# Altium project RFSoC-AMC.PrjPCB (part 21 of 22)
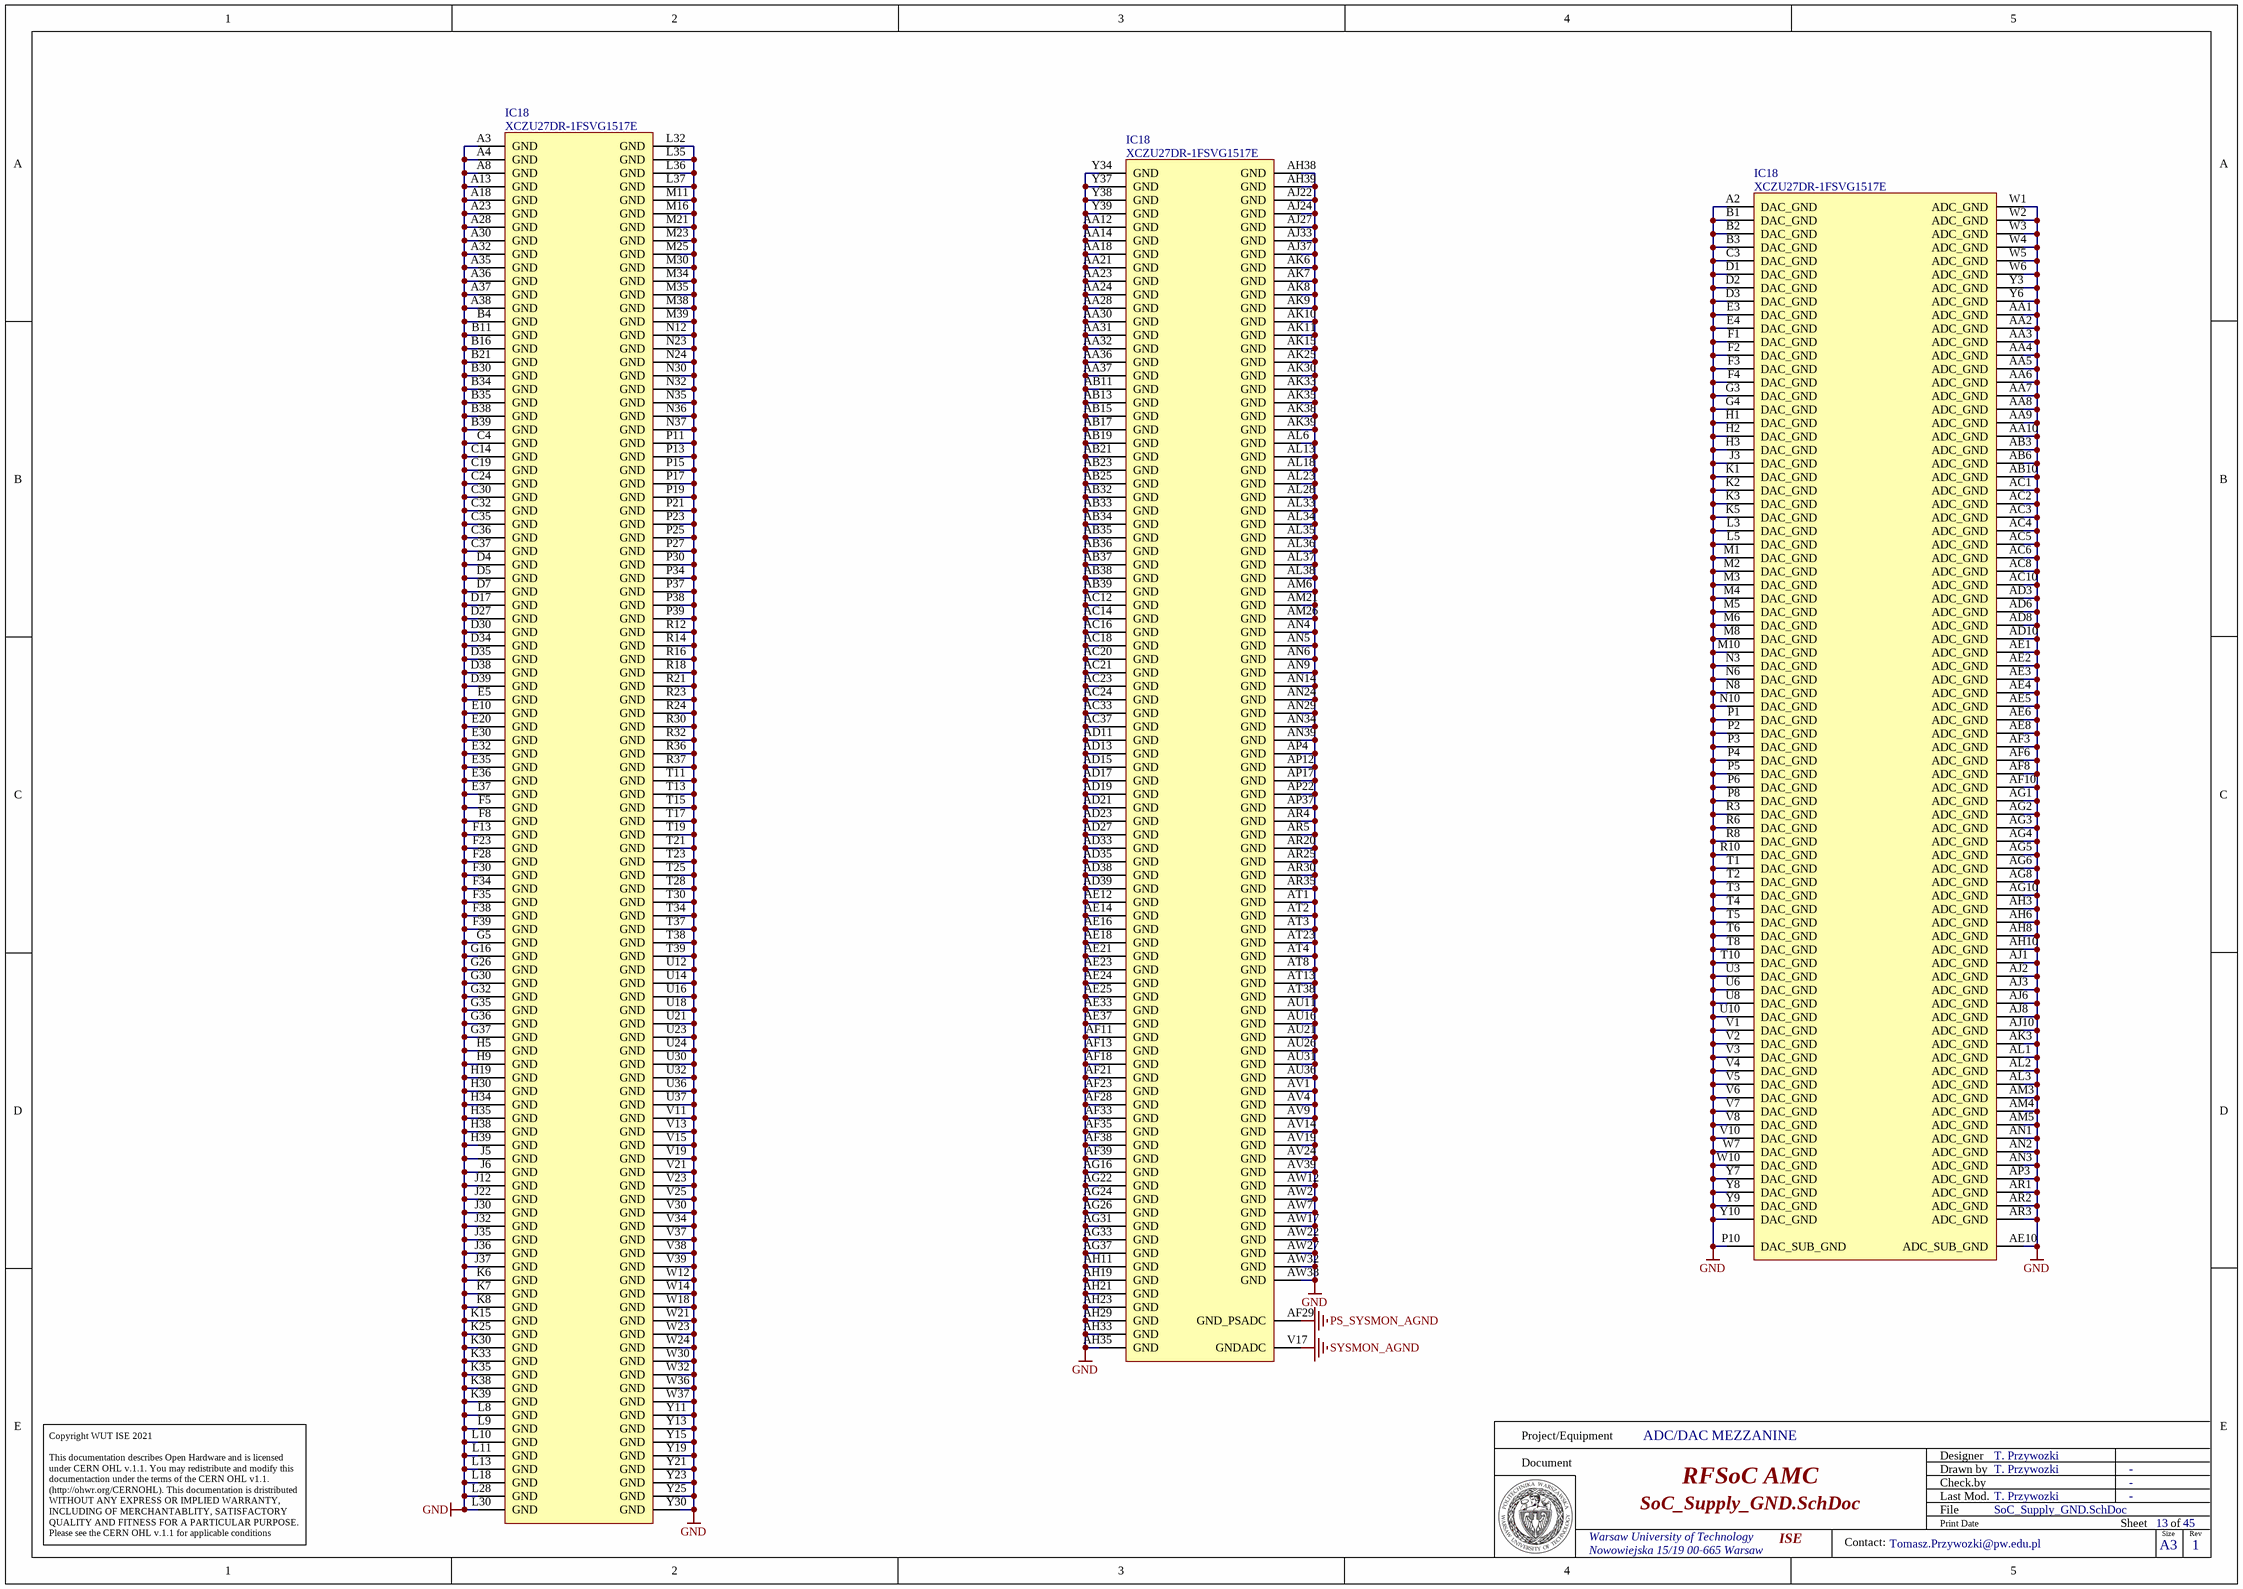
[diagram p47: SoC_Supply_GND.SchDoc]
## Nets that join several sheets
ADC_AVCC: ADC_DAC_Supply (6 pins), SoC_Supply (8 pins), SoC_Decoupling_2 (5 pins)
ADC_AVCCAUX: Supply (L49.2), SoC_Supply (8 pins), SoC_Decoupling_2 (18 pins)
AMS_CLK_VCC3V3: U_ADC_PLL (6 pins), DAC_PLL (6 pins), U_ADC_PLL (6 pins), AMS_CLOCK (13 pins), Supply_LDOs (6 pins), CDR_WR_oscillators (11 pins), SoC_FPGA_128-131_GTY (21 pins), SoC_PS_505_GTR (7 pins)
DAC_AVCC: ADC_DAC_Supply (6 pins), SoC_Supply (8 pins), SoC_Decoupling_2 (5 pins)
DAC_AVCCAUX: ADC_DAC_Supply (6 pins), SoC_Supply (8 pins), SoC_Decoupling_2 (6 pins)
DAC_AVTT: RFMC_DAC (6 pins), Power_Management_RFMC_RTM (C743.2 L5.2), SoC_Supply (IC18.H4 IC18.J4 IC18.K4 IC18.L4), SoC_Decoupling_2 (6 pins)
GND: soc (45 pins), U_DDR4_SDRAM_PL1 (166 pins), RFMC_ADC (268 pins), RFMC_DAC (253 pins), U_DDR4_SDRAM_PL2 (166 pins), U_DDR4_SDRAM_PS (166 pins), U_ADC_PLL (51 pins), DAC_PLL (51 pins), U_ADC_PLL (51 pins), AMS_CLOCK (121 pins), RTM_Connector (61 pins), ETH_PHY_SW_L2L3 (61 pins), AMC_Connector (56 pins), CPU_LPC1776_1 (18 pins), CPU_LPC1776_2 (53 pins), I2C_MUX (13 pins), SD_CARD (13 pins), MLVDS_Transceivers (30 pins), USB_SERIAL_QUAD (59 pins), Thermometers (34 pins), Power_Management_RFMC_RTM (53 pins), ADC_DAC_Supply (22 pins), Supply_CORE (81 pins), Supply_LDOs (21 pins), Supply (135 pins), VCCINT_IO_BRAM_PS (37 pins), CDR_WR_oscillators (57 pins), SoC_FPGA_67_68_69_DDR4 (21 pins), SoC_FPGA_64_65_66_DDR4 (15 pins), SoC_224-229_ADC_DAC (R512.2 R513.2), SoC_FPGA_128-131_GTY (15 pins), SoC_FPGA_Config_0 (R515#2.1 R539.1), SoC_Supply (6 pins), SoC_PS_504_DDR4 (R582.2), SoC_PS_505_GTR (6 pins), SoC_PS_Config_503 (15 pins), SoC_PS_500_501_502_MIO (30 pins), JTAG_Configuration (30 pins), USB3_CON (12 pins), USB_PHY (11 pins), FPGA_7A35T (29 pins), FPGA_7A35T_GTP (C904.1 OSC8.3 R714.1 R715.1), Clocking_SI5341B (13 pins), FPGA_7A35T_POWER (146 pins), SoC_Decoupling (89 pins), SoC_Decoupling_2 (63 pins), SoC_Supply_GND (529 pins)
MGT1V2: Supply (10 pins), SoC_Supply (21 pins), SoC_Decoupling (C669.2 C670.2), SoC_Decoupling_2 (C695.2)
MGT1V8: Supply_LDOs (C290.2 L6.2 R315.2 TP19.1), SoC_Supply (6 pins), SoC_Decoupling_2 (C702.2 C703.2)
MGTAVCC: Supply (6 pins), SoC_Supply (6 pins), SoC_Decoupling_2 (9 pins)
MGTAVCCF: Supply (C361.2 L1.2 L24.2), FPGA_7A35T_POWER (9 pins)
MGTAVTTF: Supply (C362.2 L2.2 L25.2), FPGA_7A35T_GTP (R713.1), FPGA_7A35T_POWER (11 pins)
MGTRAVCC: Supply_LDOs (6 pins), SoC_Supply (IC18.AD34 IC18.AF34 IC18.AH34), SoC_Decoupling_2 (C701.2)
P1V0: Supply (9 pins), FPGA_7A35T_POWER (39 pins)
P1V2: U_DDR4_SDRAM_PL1 (131 pins), U_DDR4_SDRAM_PL2 (131 pins), U_DDR4_SDRAM_PS (131 pins), Supply (12 pins), SoC_FPGA_67_68_69_DDR4 (6 pins), SoC_FPGA_64_65_66_DDR4 (R369.1 R440.2), SoC_Supply (25 pins), SoC_Decoupling (16 pins)
P1V8: RFMC_ADC (C78.2 C79.1 J1.a6 J1.c6), RFMC_DAC (C776.2 C932.1 J21.a35 J21.c35), ETH_PHY_SW_L2L3 (21 pins), SD_CARD (C548.1 IC48.5 R452.2), USB_SERIAL_QUAD (C848.2 IC50.6), Supply (8 pins), SoC_FPGA_Config_0 (R538.2), SoC_Supply (20 pins), SoC_PS_500_501_502_MIO (22 pins), USB_PHY (L8.1 L62.1), FPGA_7A35T (R669.1), Clocking_SI5341B (5 pins), FPGA_7A35T_POWER (15 pins), SoC_Decoupling (15 pins)
P1V13: ADC_DAC_Supply (8 pins), Supply_LDOs (C293.2 C294.2 IC16.9 IC16.10), Supply (6 pins)
P2V5: U_DDR4_SDRAM_PL1 (18 pins), U_DDR4_SDRAM_PL2 (18 pins), U_DDR4_SDRAM_PS (18 pins), Power_Management_RFMC_RTM (5 pins), ADC_DAC_Supply (C309.2 C310.2 IC20.9 IC20.10), Supply_LDOs (C93.2 IC15.9 IC15.10), FPGA_7A35T (5 pins), FPGA_7A35T_GTP (L68.2), FPGA_7A35T_POWER (15 pins)
P3V3: U_DDR4_SDRAM_PL1 (C5_U_DDR4_SDRAM_PL1.1 IC5_U_DDR4_SDRAM_PL1.7 IC5_U_DDR4_SDRAM_PL1.10), RFMC_ADC (12 pins), RFMC_DAC (11 pins), U_DDR4_SDRAM_PL2 (C5_U_DDR4_SDRAM_PL2.1 IC5_U_DDR4_SDRAM_PL2.7 IC5_U_DDR4_SDRAM_PL2.10), U_DDR4_SDRAM_PS (C5_U_DDR4_SDRAM_PS.1 IC5_U_DDR4_SDRAM_PS.7 IC5_U_DDR4_SDRAM_PS.10), ETH_PHY_SW_L2L3 (L34.1), CPU_LPC1776_1 (R37.2), I2C_MUX (10 pins), SD_CARD (7 pins), MLVDS_Transceivers (22 pins), USB_SERIAL_QUAD (6 pins), ADC_DAC_Supply (6 pins), Supply_LDOs (C291.2 C298.2 IC15.4 IC16.4), Supply (6 pins), CDR_WR_oscillators (R468.1), SoC_Supply (6 pins), SoC_PS_Config_503 (15 pins), SoC_PS_500_501_502_MIO (8 pins), JTAG_Configuration (15 pins), USB3_CON (LD14.2), USB_PHY (C823.2 IC71.20 IC71.21), FPGA_7A35T (11 pins), Clocking_SI5341B (19 pins), FPGA_7A35T_POWER (20 pins), SoC_Decoupling (5 pins)
P3V3MP: AMC_Connector (P1.4), CPU_LPC1776_1 (23 pins), CPU_LPC1776_2 (41 pins), I2C_MUX (22 pins), USB_SERIAL_QUAD (C818.2 C854.2 IC53.6 IC58.6), Thermometers (27 pins), Power_Management_RFMC_RTM (12 pins), ADC_DAC_Supply (R329.2 R333.2 R383.2), Supply_LDOs (R321.2 R326.2 R328.2), Supply (R107.2 R109.2 R131.2), VCCINT_IO_BRAM_PS (R654.2), SoC_FPGA_67_68_69_DDR4 (C746.2 C799.2 IC45.6 IC46.6), SoC_PS_500_501_502_MIO (6 pins), JTAG_Configuration (5 pins)
P3V3MP_RTM: RTM_Connector (J4.c2), Power_Management_RFMC_RTM (F1.2)
P3V5: Supply_LDOs (C285.2 IC7.9 IC7.10 R188.2), Supply (6 pins)
P5V0: Power_Management_RFMC_RTM (5 pins), USB3_CON (C819.2 IC70.7)
P12V0: RFMC_ADC (C80.2 C81.1 C82.1), RFMC_DAC (8 pins), Power_Management_RFMC_RTM (21 pins), Supply_CORE (30 pins), Supply (33 pins), VCCINT_IO_BRAM_PS (11 pins)
P12V0_Molex: CPU_LPC1776_2 (R377.2), Power_Management_RFMC_RTM (10 pins)
P12V0_RTM: RTM_Connector (J4.a1 J4.a2 J4.b1 J4.b2), Power_Management_RFMC_RTM (IC40.2 R389.2 R390.2)
PAYLOAD_PWR: AMC_Connector (8 pins), Power_Management_RFMC_RTM (5 pins)
PSADC_GND: SoC_Supply (C803.1 C804.1 L55.2), SoC_Supply_GND (IC18.AF29)
SYSMON_AGND: SoC_FPGA_Config_0 (IC18.W16 IC18.W17 IC18.Y16 R541.2), SoC_Supply (C741.1 C742.1 L42.2), SoC_Supply_GND (IC18.V17)
VCCAUXF: Supply (L7.2), FPGA_7A35T_POWER (13 pins)
VCCBRAMF: Supply (C363.2 L3.2), FPGA_7A35T_POWER (7 pins)
VCCINT: Supply_CORE (37 pins), SoC_FPGA_Config_0 (R514#2.2), SoC_Supply (60 pins), SoC_Decoupling (13 pins)
VCCINT_AMS: Supply (10 pins), SoC_Supply (9 pins), SoC_Decoupling_2 (10 pins)
VCCINT_IO_BRAM_PS_SDFEC: VCCINT_IO_BRAM_PS (19 pins), SoC_Supply (38 pins), SoC_Decoupling (38 pins)
VDD33: I2C_MUX (R145.1 R146.1), Supply_CORE (6 pins)
ADC0_IN_N: RFMC_ADC (J1.f9), SoC_224-229_ADC_DAC (IC18.AP1)
ADC0_IN_P: RFMC_ADC (J1.g9), SoC_224-229_ADC_DAC (IC18.AP2)
ADC1_IN_N: RFMC_ADC (J1.b10), SoC_224-229_ADC_DAC (IC18.AM1)
ADC1_IN_P: RFMC_ADC (J1.c10), SoC_224-229_ADC_DAC (IC18.AM2)
ADC2_IN_N: RFMC_ADC (J1.f12), SoC_224-229_ADC_DAC (IC18.AK1)
ADC2_IN_P: RFMC_ADC (J1.g12), SoC_224-229_ADC_DAC (IC18.AK2)
ADC3_IN_N: RFMC_ADC (J1.b13), SoC_224-229_ADC_DAC (IC18.AH1)
ADC3_IN_P: RFMC_ADC (J1.c13), SoC_224-229_ADC_DAC (IC18.AH2)
ADC4_IN_N: RFMC_ADC (J1.f15), SoC_224-229_ADC_DAC (IC18.AF1)
ADC4_IN_P: RFMC_ADC (J1.g15), SoC_224-229_ADC_DAC (IC18.AF2)
ADC5_IN_N: RFMC_ADC (J1.b16), SoC_224-229_ADC_DAC (IC18.AD1)
ADC5_IN_P: RFMC_ADC (J1.c16), SoC_224-229_ADC_DAC (IC18.AD2)
ADC6_IN_N: RFMC_ADC (J1.f18), SoC_224-229_ADC_DAC (IC18.AB1)
ADC6_IN_P: RFMC_ADC (J1.g18), SoC_224-229_ADC_DAC (IC18.AB2)
ADC7_IN_N: RFMC_ADC (J1.b19), SoC_224-229_ADC_DAC (IC18.Y1)
ADC7_IN_P: RFMC_ADC (J1.c19), SoC_224-229_ADC_DAC (IC18.Y2)
ADCIO_0: RFMC_ADC (J1.a2), FPGA_7A35T (IC84.R6)
ADCIO_1: RFMC_ADC (J1.a4), FPGA_7A35T (IC84.T3)
ADCIO_2: RFMC_ADC (J1.b1), FPGA_7A35T (IC84.P6)
ADCIO_3: RFMC_ADC (J1.b3), FPGA_7A35T (IC84.R7)
ADCIO_4: RFMC_ADC (J1.b5), FPGA_7A35T (IC84.U1)
ADCIO_5: RFMC_ADC (J1.c2), FPGA_7A35T (IC84.V7)
ADCIO_6: RFMC_ADC (J1.c4), FPGA_7A35T (IC84.U4)
ADCIO_7: RFMC_ADC (J1.d1), FPGA_7A35T (IC84.P5)
ADCIO_8: RFMC_ADC (J1.d3), FPGA_7A35T (IC84.U5)
ADCIO_9: RFMC_ADC (J1.d5), FPGA_7A35T (IC84.V2)
ADCIO_10: RFMC_ADC (J1.e2), FPGA_7A35T (IC84.V8)
ADCIO_11: RFMC_ADC (J1.e4), FPGA_7A35T (IC84.V4)
ADCIO_12: RFMC_ADC (J1.f1), FPGA_7A35T (IC84.R5)
ADCIO_13: RFMC_ADC (J1.f3), FPGA_7A35T (IC84.V6)
ADCIO_14: RFMC_ADC (J1.f5), FPGA_7A35T (IC84.T4)
ADCIO_15: RFMC_ADC (J1.g2), FPGA_7A35T (IC84.U6)
ADCIO_16: RFMC_ADC (J1.g4), FPGA_7A35T (IC84.T5)
ADCIO_17: RFMC_ADC (J1.h1), FPGA_7A35T (IC84.T7)
ADCIO_18: RFMC_ADC (J1.h3), FPGA_7A35T (IC84.U7)
ADCIO_19: RFMC_ADC (J1.h5), FPGA_7A35T (IC84.V3)
ADCLK_IN0_N: RFMC_ADC (J1.b36), U_ADC_PLL (C224_U_ADC_PLL#1.2)
ADCLK_IN0_P: RFMC_ADC (J1.c36), U_ADC_PLL (C91_U_ADC_PLL#1.2)
ADCLK_IN1_N: RFMC_ADC (J1.f35), U_ADC_PLL (C227_U_ADC_PLL#1.2)
ADCLK_IN1_P: RFMC_ADC (J1.g35), U_ADC_PLL (C769_U_ADC_PLL#1.2)
ADCLK_IN2_N: RFMC_ADC (J1.b39), U_ADC_PLL (C224_U_ADC_PLL#2.2)
ADCLK_IN2_P: RFMC_ADC (J1.c39), U_ADC_PLL (C91_U_ADC_PLL#2.2)
ADCLK_IN3_N: RFMC_ADC (J1.f38), U_ADC_PLL (C227_U_ADC_PLL#2.2)
ADCLK_IN3_P: RFMC_ADC (J1.g38), U_ADC_PLL (C769_U_ADC_PLL#2.2)
AMC_CLK_N: RTM_Connector (J4.b3), Clocking_SI5341B (IC83.58)
AMC_CLK_P: RTM_Connector (J4.a3), Clocking_SI5341B (IC83.59)
AMC_En: AMC_Connector (P1.41), CPU_LPC1776_1 (R191.1 R194.1), CPU_LPC1776_2 (D12.1 R228.1 T1.1 T13.3)
AMC_TCK: AMC_Connector (P1.165), JTAG_Configuration (D16.1 IC34.9 R356.2)
AMC_TCLKA_N: RTM_Connector (J4.b4), CDR_WR_oscillators (IC22.4)
AMC_TCLKA_P: RTM_Connector (J4.a4), CDR_WR_oscillators (IC22.3)
AMC_TDI: AMC_Connector (P1.169), JTAG_Configuration (D14.1 IC34.4 R355.2)
AMC_TDO: AMC_Connector (P1.168), JTAG_Configuration (D17.1 IC34.7 R354.2)
AMC_TMS: AMC_Connector (P1.166), JTAG_Configuration (D15.1 IC34.12 R353.2)
AMC_TRSTn: AMC_Connector (P1.167), JTAG_Configuration (D13.1 D18.1 R352.2 R361.2)
ARTIX_FPGA_SCL: I2C_MUX (B19.1 IC32.19 R325.1), FPGA_7A35T (IC84.R13)
ARTIX_FPGA_SDA: I2C_MUX (B18.1 IC32.20 R322.1), FPGA_7A35T (IC84.T13)
ARTIX_SoC_Rx0_N: SoC_FPGA_128-131_GTY (C516.2 IC18.G34), FPGA_7A35T_GTP (C1009.2)
ARTIX_SoC_Rx0_P: SoC_FPGA_128-131_GTY (C518.2 IC18.G33), FPGA_7A35T_GTP (C1008.2)
ARTIX_SoC_Rx1_N: SoC_FPGA_128-131_GTY (C509.2 IC18.H32), FPGA_7A35T_GTP (C1011.2)
ARTIX_SoC_Rx1_P: SoC_FPGA_128-131_GTY (C512.2 IC18.H31), FPGA_7A35T_GTP (C1010.2)
ARTIX_SoC_Tx0_N: SoC_FPGA_128-131_GTY (C515.2 IC18.H37), FPGA_7A35T_GTP (C910.1)
ARTIX_SoC_Tx0_P: SoC_FPGA_128-131_GTY (C517.2 IC18.H36), FPGA_7A35T_GTP (C909.1)
ARTIX_SoC_Tx1_N: SoC_FPGA_128-131_GTY (C508.2 IC18.J39), FPGA_7A35T_GTP (C912.1)
ARTIX_SoC_Tx1_P: SoC_FPGA_128-131_GTY (C511.2 IC18.J38), FPGA_7A35T_GTP (C911.1)
ARTIX_TCK: JTAG_Configuration (IC35.16), FPGA_7A35T (IC84.F8)
ARTIX_TDI: JTAG_Configuration (R50.1), FPGA_7A35T (IC84.T9)
ARTIX_TDO: JTAG_Configuration (R368.2), FPGA_7A35T (IC84.T8)
ARTIX_TMS: JTAG_Configuration (IC35.13), FPGA_7A35T (IC84.R8)
ARTIX_UART_Rx: SoC_FPGA_HD_84_87 (IC18.AV6), FPGA_7A35T (IC84.N14)
ARTIX_UART_Tx: SoC_FPGA_HD_84_87 (IC18.AV5), FPGA_7A35T (IC84.M14)
BOOT_MODE0: CPU_LPC1776_1 (IC24.P9), SoC_PS_Config_503 (R593.2)
BOOT_MODE1: CPU_LPC1776_1 (IC24.P11), SoC_PS_Config_503 (R591.2)
BOOT_MODE2: CPU_LPC1776_1 (IC24.P3), SoC_PS_Config_503 (R589.2)
BOOT_MODE3: CPU_LPC1776_1 (IC24.N5), SoC_PS_Config_503 (R587.2)
CDR_CLK_CLEAN2_N: CDR_WR_oscillators (C594.2), FPGA_7A35T (IC84.D15 R694.2)
CDR_CLK_CLEAN2_P: CDR_WR_oscillators (C591.2), FPGA_7A35T (IC84.E15 R693.2)
CDR_CLK_CTRL.CDR_CLK_CLEAN1_N: CDR_WR_oscillators (C596.2), FPGA_7A35T_GTP (IC84.B5)
CDR_CLK_CTRL.CDR_CLK_CLEAN1_P: CDR_WR_oscillators (C595.2), FPGA_7A35T_GTP (IC84.B6)
CLK_4208_IN1_N: AMS_CLOCK (C138.1 R64.1), CDR_WR_oscillators (C582.2)
CLK_4208_IN1_P: AMS_CLOCK (C137.1 R64.2), CDR_WR_oscillators (C581.2)
CSB_ADC0: U_ADC_PLL (R167_U_ADC_PLL#1.2), FPGA_7A35T (IC84.T18)
CSB_ADC1: U_ADC_PLL (R167_U_ADC_PLL#2.2), FPGA_7A35T (IC84.T17)
CSB_DAC: DAC_PLL (R93.2), FPGA_7A35T (IC84.R18)
DAC0_OUT_N: RFMC_DAC (J21.b10), SoC_224-229_ADC_DAC (IC18.U1)
DAC0_OUT_P: RFMC_DAC (J21.c10), SoC_224-229_ADC_DAC (IC18.U2)
DAC1_OUT_N: RFMC_DAC (J21.f11), SoC_224-229_ADC_DAC (IC18.R1)
DAC1_OUT_P: RFMC_DAC (J21.g11), SoC_224-229_ADC_DAC (IC18.R2)
DAC2_OUT_N: RFMC_DAC (J21.b13), SoC_224-229_ADC_DAC (IC18.N1)
DAC2_OUT_P: RFMC_DAC (J21.c13), SoC_224-229_ADC_DAC (IC18.N2)
DAC3_OUT_N: RFMC_DAC (J21.f14), SoC_224-229_ADC_DAC (IC18.L1)
DAC3_OUT_P: RFMC_DAC (J21.g14), SoC_224-229_ADC_DAC (IC18.L2)
DAC4_OUT_N: RFMC_DAC (J21.b16), SoC_224-229_ADC_DAC (IC18.J1)
DAC4_OUT_P: RFMC_DAC (J21.c16), SoC_224-229_ADC_DAC (IC18.J2)
DAC5_OUT_N: RFMC_DAC (J21.f17), SoC_224-229_ADC_DAC (IC18.G1)
DAC5_OUT_P: RFMC_DAC (J21.g17), SoC_224-229_ADC_DAC (IC18.G2)
DAC6_OUT_N: RFMC_DAC (J21.b19), SoC_224-229_ADC_DAC (IC18.E1)
DAC6_OUT_P: RFMC_DAC (J21.c19), SoC_224-229_ADC_DAC (IC18.E2)
DAC7_OUT_N: RFMC_DAC (J21.f20), SoC_224-229_ADC_DAC (IC18.C1)
DAC7_OUT_P: RFMC_DAC (J21.g20), SoC_224-229_ADC_DAC (IC18.C2)
DACIO_0: RFMC_DAC (J21.a37), FPGA_7A35T (IC84.J6)
DACIO_1: RFMC_DAC (J21.a39), FPGA_7A35T (IC84.K6)
DACIO_2: RFMC_DAC (J21.b36), FPGA_7A35T (IC84.M6)
DACIO_3: RFMC_DAC (J21.b38), FPGA_7A35T (IC84.N6)
DACIO_4: RFMC_DAC (J21.b40), FPGA_7A35T (IC84.L5)
DACIO_5: RFMC_DAC (J21.c37), FPGA_7A35T (IC84.M5)
DACIO_6: RFMC_DAC (J21.c39), FPGA_7A35T (IC84.L4)
DACIO_7: RFMC_DAC (J21.d36), FPGA_7A35T (IC84.M4)
DACIO_8: RFMC_DAC (J21.d38), FPGA_7A35T (IC84.L3)
DACIO_9: RFMC_DAC (J21.d40), FPGA_7A35T (IC84.M2)
DACIO_10: RFMC_DAC (J21.e37), FPGA_7A35T (IC84.P1)
DACIO_11: RFMC_DAC (J21.e39), FPGA_7A35T (IC84.M1)
DACIO_12: RFMC_DAC (J21.f36), FPGA_7A35T (IC84.N1)
DACIO_13: RFMC_DAC (J21.f38), FPGA_7A35T (IC84.L2)
DACIO_14: RFMC_DAC (J21.f40), FPGA_7A35T (IC84.K1)
DACIO_15: RFMC_DAC (J21.g37), FPGA_7A35T (IC84.K3)
DACIO_16: RFMC_DAC (J21.g39), FPGA_7A35T (IC84.K5)
DACIO_17: RFMC_DAC (J21.h36), FPGA_7A35T (IC84.K2)
DACIO_18: RFMC_DAC (J21.h38), FPGA_7A35T (IC84.J4)
DACIO_19: RFMC_DAC (J21.h40), FPGA_7A35T (IC84.J5)
DACLK_IN0_N: RFMC_DAC (J21.b4), DAC_PLL (C88.2)
DACLK_IN0_P: RFMC_DAC (J21.c4), DAC_PLL (C87.2)
DACLK_IN1_N: RFMC_DAC (J21.f5), DAC_PLL (C89.2)
DACLK_IN1_P: RFMC_DAC (J21.g5), DAC_PLL (C90.2)
DDR4_1_A0: U_DDR4_SDRAM_PL2 (5 pins), SoC_FPGA_64_65_66_DDR4 (IC18.AK17)
DDR4_1_A1: U_DDR4_SDRAM_PL2 (5 pins), SoC_FPGA_64_65_66_DDR4 (IC18.AL15)
DDR4_1_A2: U_DDR4_SDRAM_PL2 (5 pins), SoC_FPGA_64_65_66_DDR4 (IC18.AN15)
DDR4_1_A3: U_DDR4_SDRAM_PL2 (5 pins), SoC_FPGA_64_65_66_DDR4 (IC18.AM15)
DDR4_1_A4: U_DDR4_SDRAM_PL2 (5 pins), SoC_FPGA_64_65_66_DDR4 (IC18.AN16)
DDR4_1_A5: U_DDR4_SDRAM_PL2 (5 pins), SoC_FPGA_64_65_66_DDR4 (IC18.AN17)
DDR4_1_A6: U_DDR4_SDRAM_PL2 (5 pins), SoC_FPGA_64_65_66_DDR4 (IC18.AR14)
DDR4_1_A7: U_DDR4_SDRAM_PL2 (5 pins), SoC_FPGA_64_65_66_DDR4 (IC18.AP14)
DDR4_1_A8: U_DDR4_SDRAM_PL2 (5 pins), SoC_FPGA_64_65_66_DDR4 (IC18.AR16)
DDR4_1_A9: U_DDR4_SDRAM_PL2 (5 pins), SoC_FPGA_64_65_66_DDR4 (IC18.AP16)
DDR4_1_A10: U_DDR4_SDRAM_PL2 (5 pins), SoC_FPGA_64_65_66_DDR4 (IC18.AR13)
DDR4_1_A11: U_DDR4_SDRAM_PL2 (5 pins), SoC_FPGA_64_65_66_DDR4 (IC18.AP13)
DDR4_1_A12: U_DDR4_SDRAM_PL2 (5 pins), SoC_FPGA_64_65_66_DDR4 (IC18.AW15)
DDR4_1_A13: U_DDR4_SDRAM_PL2 (5 pins), SoC_FPGA_64_65_66_DDR4 (IC18.AV15)
DDR4_1_DM0: U_DDR4_SDRAM_PL2 (IC1_U_DDR4_SDRAM_PL2.E7), SoC_FPGA_64_65_66_DDR4 (IC18.AM12)
DDR4_1_DM1: U_DDR4_SDRAM_PL2 (IC1_U_DDR4_SDRAM_PL2.E2), SoC_FPGA_64_65_66_DDR4 (IC18.AK13)
DDR4_1_DM2: U_DDR4_SDRAM_PL2 (IC2_U_DDR4_SDRAM_PL2.E7), SoC_FPGA_64_65_66_DDR4 (IC18.AV10)
DDR4_1_DM3: U_DDR4_SDRAM_PL2 (IC2_U_DDR4_SDRAM_PL2.E2), SoC_FPGA_64_65_66_DDR4 (IC18.AP8)
DDR4_1_DM4: U_DDR4_SDRAM_PL2 (IC3_U_DDR4_SDRAM_PL2.E7), SoC_FPGA_64_65_66_DDR4 (IC18.AM20)
DDR4_1_DM5: U_DDR4_SDRAM_PL2 (IC3_U_DDR4_SDRAM_PL2.E2), SoC_FPGA_64_65_66_DDR4 (IC18.AJ18)
DDR4_1_DM6: U_DDR4_SDRAM_PL2 (IC4_U_DDR4_SDRAM_PL2.E7), SoC_FPGA_64_65_66_DDR4 (IC18.AW19)
DDR4_1_DM7: U_DDR4_SDRAM_PL2 (IC4_U_DDR4_SDRAM_PL2.E2), SoC_FPGA_64_65_66_DDR4 (IC18.AR17)
DDR4_1_DQ0: U_DDR4_SDRAM_PL2 (IC1_U_DDR4_SDRAM_PL2.G2), SoC_FPGA_64_65_66_DDR4 (IC18.AN10)
DDR4_1_DQ1: U_DDR4_SDRAM_PL2 (IC1_U_DDR4_SDRAM_PL2.F7), SoC_FPGA_64_65_66_DDR4 (IC18.AP11)
DDR4_1_DQ2: U_DDR4_SDRAM_PL2 (IC1_U_DDR4_SDRAM_PL2.H3), SoC_FPGA_64_65_66_DDR4 (IC18.AM10)
DDR4_1_DQ3: U_DDR4_SDRAM_PL2 (IC1_U_DDR4_SDRAM_PL2.H7), SoC_FPGA_64_65_66_DDR4 (IC18.AN11)
DDR4_1_DQ4: U_DDR4_SDRAM_PL2 (IC1_U_DDR4_SDRAM_PL2.H2), SoC_FPGA_64_65_66_DDR4 (IC18.AL10)
DDR4_1_DQ5: U_DDR4_SDRAM_PL2 (IC1_U_DDR4_SDRAM_PL2.H8), SoC_FPGA_64_65_66_DDR4 (IC18.AR11)
DDR4_1_DQ6: U_DDR4_SDRAM_PL2 (IC1_U_DDR4_SDRAM_PL2.J3), SoC_FPGA_64_65_66_DDR4 (IC18.AP10)
DDR4_1_DQ7: U_DDR4_SDRAM_PL2 (IC1_U_DDR4_SDRAM_PL2.J7), SoC_FPGA_64_65_66_DDR4 (IC18.AR12)
DDR4_1_DQ8: U_DDR4_SDRAM_PL2 (IC1_U_DDR4_SDRAM_PL2.A3), SoC_FPGA_64_65_66_DDR4 (IC18.AH12)
DDR4_1_DQ9: U_DDR4_SDRAM_PL2 (IC1_U_DDR4_SDRAM_PL2.B8), SoC_FPGA_64_65_66_DDR4 (IC18.AL14)
DDR4_1_DQ10: U_DDR4_SDRAM_PL2 (IC1_U_DDR4_SDRAM_PL2.C3), SoC_FPGA_64_65_66_DDR4 (IC18.AK12)
DDR4_1_DQ11: U_DDR4_SDRAM_PL2 (IC1_U_DDR4_SDRAM_PL2.C7), SoC_FPGA_64_65_66_DDR4 (IC18.AH13)
DDR4_1_DQ12: U_DDR4_SDRAM_PL2 (IC1_U_DDR4_SDRAM_PL2.C2), SoC_FPGA_64_65_66_DDR4 (IC18.AG12)
DDR4_1_DQ13: U_DDR4_SDRAM_PL2 (IC1_U_DDR4_SDRAM_PL2.C8), SoC_FPGA_64_65_66_DDR4 (IC18.AM14)
DDR4_1_DQ14: U_DDR4_SDRAM_PL2 (IC1_U_DDR4_SDRAM_PL2.D3), SoC_FPGA_64_65_66_DDR4 (IC18.AJ12)
DDR4_1_DQ15: U_DDR4_SDRAM_PL2 (IC1_U_DDR4_SDRAM_PL2.D7), SoC_FPGA_64_65_66_DDR4 (IC18.AJ13)
DDR4_1_DQ16: U_DDR4_SDRAM_PL2 (IC2_U_DDR4_SDRAM_PL2.G2), SoC_FPGA_64_65_66_DDR4 (IC18.AU12)
DDR4_1_DQ17: U_DDR4_SDRAM_PL2 (IC2_U_DDR4_SDRAM_PL2.F7), SoC_FPGA_64_65_66_DDR4 (IC18.AW9)
DDR4_1_DQ18: U_DDR4_SDRAM_PL2 (IC2_U_DDR4_SDRAM_PL2.H3), SoC_FPGA_64_65_66_DDR4 (IC18.AU10)
DDR4_1_DQ19: U_DDR4_SDRAM_PL2 (IC2_U_DDR4_SDRAM_PL2.H7), SoC_FPGA_64_65_66_DDR4 (IC18.AV11)
DDR4_1_DQ20: U_DDR4_SDRAM_PL2 (IC2_U_DDR4_SDRAM_PL2.H2), SoC_FPGA_64_65_66_DDR4 (IC18.AT10)
DDR4_1_DQ21: U_DDR4_SDRAM_PL2 (IC2_U_DDR4_SDRAM_PL2.H8), SoC_FPGA_64_65_66_DDR4 (IC18.AV12)
DDR4_1_DQ22: U_DDR4_SDRAM_PL2 (IC2_U_DDR4_SDRAM_PL2.J3), SoC_FPGA_64_65_66_DDR4 (IC18.AW8)
DDR4_1_DQ23: U_DDR4_SDRAM_PL2 (IC2_U_DDR4_SDRAM_PL2.J7), SoC_FPGA_64_65_66_DDR4 (IC18.AW11)
DDR4_1_DQ24: U_DDR4_SDRAM_PL2 (IC2_U_DDR4_SDRAM_PL2.A3), SoC_FPGA_64_65_66_DDR4 (IC18.AL7)
DDR4_1_DQ25: U_DDR4_SDRAM_PL2 (IC2_U_DDR4_SDRAM_PL2.B8), SoC_FPGA_64_65_66_DDR4 (IC18.AL9)
DDR4_1_DQ26: U_DDR4_SDRAM_PL2 (IC2_U_DDR4_SDRAM_PL2.C3), SoC_FPGA_64_65_66_DDR4 (IC18.AM8)
DDR4_1_DQ27: U_DDR4_SDRAM_PL2 (IC2_U_DDR4_SDRAM_PL2.C7), SoC_FPGA_64_65_66_DDR4 (IC18.AM9)
DDR4_1_DQ28: U_DDR4_SDRAM_PL2 (IC2_U_DDR4_SDRAM_PL2.C2), SoC_FPGA_64_65_66_DDR4 (IC18.AL8)
DDR4_1_DQ29: U_DDR4_SDRAM_PL2 (IC2_U_DDR4_SDRAM_PL2.C8), SoC_FPGA_64_65_66_DDR4 (IC18.AR9)
DDR4_1_DQ30: U_DDR4_SDRAM_PL2 (IC2_U_DDR4_SDRAM_PL2.D3), SoC_FPGA_64_65_66_DDR4 (IC18.AM7)
DDR4_1_DQ31: U_DDR4_SDRAM_PL2 (IC2_U_DDR4_SDRAM_PL2.D7), SoC_FPGA_64_65_66_DDR4 (IC18.AP9)
DDR4_1_DQ32: U_DDR4_SDRAM_PL2 (IC3_U_DDR4_SDRAM_PL2.G2), SoC_FPGA_64_65_66_DDR4 (IC18.AM19)
DDR4_1_DQ33: U_DDR4_SDRAM_PL2 (IC3_U_DDR4_SDRAM_PL2.F7), SoC_FPGA_64_65_66_DDR4 (IC18.AL21)
DDR4_1_DQ34: U_DDR4_SDRAM_PL2 (IC3_U_DDR4_SDRAM_PL2.H3), SoC_FPGA_64_65_66_DDR4 (IC18.AP21)
DDR4_1_DQ35: U_DDR4_SDRAM_PL2 (IC3_U_DDR4_SDRAM_PL2.H7), SoC_FPGA_64_65_66_DDR4 (IC18.AN21)
DDR4_1_DQ36: U_DDR4_SDRAM_PL2 (IC3_U_DDR4_SDRAM_PL2.H2), SoC_FPGA_64_65_66_DDR4 (IC18.AN18)
DDR4_1_DQ37: U_DDR4_SDRAM_PL2 (IC3_U_DDR4_SDRAM_PL2.H8), SoC_FPGA_64_65_66_DDR4 (IC18.AL20)
DDR4_1_DQ38: U_DDR4_SDRAM_PL2 (IC3_U_DDR4_SDRAM_PL2.J3), SoC_FPGA_64_65_66_DDR4 (IC18.AM18)
DDR4_1_DQ39: U_DDR4_SDRAM_PL2 (IC3_U_DDR4_SDRAM_PL2.J7), SoC_FPGA_64_65_66_DDR4 (IC18.AL19)
DDR4_1_DQ40: U_DDR4_SDRAM_PL2 (IC3_U_DDR4_SDRAM_PL2.A3), SoC_FPGA_64_65_66_DDR4 (IC18.AJ20)
DDR4_1_DQ41: U_DDR4_SDRAM_PL2 (IC3_U_DDR4_SDRAM_PL2.B8), SoC_FPGA_64_65_66_DDR4 (IC18.AF20)
DDR4_1_DQ42: U_DDR4_SDRAM_PL2 (IC3_U_DDR4_SDRAM_PL2.C3), SoC_FPGA_64_65_66_DDR4 (IC18.AJ19)
DDR4_1_DQ43: U_DDR4_SDRAM_PL2 (IC3_U_DDR4_SDRAM_PL2.C7), SoC_FPGA_64_65_66_DDR4 (IC18.AF19)
DDR4_1_DQ44: U_DDR4_SDRAM_PL2 (IC3_U_DDR4_SDRAM_PL2.C2), SoC_FPGA_64_65_66_DDR4 (IC18.AH18)
DDR4_1_DQ45: U_DDR4_SDRAM_PL2 (IC3_U_DDR4_SDRAM_PL2.C8), SoC_FPGA_64_65_66_DDR4 (IC18.AK22)
DDR4_1_DQ46: U_DDR4_SDRAM_PL2 (IC3_U_DDR4_SDRAM_PL2.D3), SoC_FPGA_64_65_66_DDR4 (IC18.AG18)
DDR4_1_DQ47: U_DDR4_SDRAM_PL2 (IC3_U_DDR4_SDRAM_PL2.D7), SoC_FPGA_64_65_66_DDR4 (IC18.AK21)
DDR4_1_DQ48: U_DDR4_SDRAM_PL2 (IC4_U_DDR4_SDRAM_PL2.G2), SoC_FPGA_64_65_66_DDR4 (IC18.AU17)
DDR4_1_DQ49: U_DDR4_SDRAM_PL2 (IC4_U_DDR4_SDRAM_PL2.F7), SoC_FPGA_64_65_66_DDR4 (IC18.AU20)
DDR4_1_DQ50: U_DDR4_SDRAM_PL2 (IC4_U_DDR4_SDRAM_PL2.H3), SoC_FPGA_64_65_66_DDR4 (IC18.AV18)
DDR4_1_DQ51: U_DDR4_SDRAM_PL2 (IC4_U_DDR4_SDRAM_PL2.H7), SoC_FPGA_64_65_66_DDR4 (IC18.AU19)
DDR4_1_DQ52: U_DDR4_SDRAM_PL2 (IC4_U_DDR4_SDRAM_PL2.H2), SoC_FPGA_64_65_66_DDR4 (IC18.AV17)
DDR4_1_DQ53: U_DDR4_SDRAM_PL2 (IC4_U_DDR4_SDRAM_PL2.H8), SoC_FPGA_64_65_66_DDR4 (IC18.AV20)
DDR4_1_DQ54: U_DDR4_SDRAM_PL2 (IC4_U_DDR4_SDRAM_PL2.J3), SoC_FPGA_64_65_66_DDR4 (IC18.AU18)
DDR4_1_DQ55: U_DDR4_SDRAM_PL2 (IC4_U_DDR4_SDRAM_PL2.J7), SoC_FPGA_64_65_66_DDR4 (IC18.AW20)
DDR4_1_DQ56: U_DDR4_SDRAM_PL2 (IC4_U_DDR4_SDRAM_PL2.A3), SoC_FPGA_64_65_66_DDR4 (IC18.AT19)
DDR4_1_DQ57: U_DDR4_SDRAM_PL2 (IC4_U_DDR4_SDRAM_PL2.B8), SoC_FPGA_64_65_66_DDR4 (IC18.AR21)
DDR4_1_DQ58: U_DDR4_SDRAM_PL2 (IC4_U_DDR4_SDRAM_PL2.C3), SoC_FPGA_64_65_66_DDR4 (IC18.AR19)
DDR4_1_DQ59: U_DDR4_SDRAM_PL2 (IC4_U_DDR4_SDRAM_PL2.C7), SoC_FPGA_64_65_66_DDR4 (IC18.AP20)
DDR4_1_DQ60: U_DDR4_SDRAM_PL2 (IC4_U_DDR4_SDRAM_PL2.C2), SoC_FPGA_64_65_66_DDR4 (IC18.AR18)
DDR4_1_DQ61: U_DDR4_SDRAM_PL2 (IC4_U_DDR4_SDRAM_PL2.C8), SoC_FPGA_64_65_66_DDR4 (IC18.AT21)
DDR4_1_DQ62: U_DDR4_SDRAM_PL2 (IC4_U_DDR4_SDRAM_PL2.D3), SoC_FPGA_64_65_66_DDR4 (IC18.AP18)
DDR4_1_DQ63: U_DDR4_SDRAM_PL2 (IC4_U_DDR4_SDRAM_PL2.D7), SoC_FPGA_64_65_66_DDR4 (IC18.AP19)
DDR4_2_A0: U_DDR4_SDRAM_PL1 (5 pins), SoC_FPGA_67_68_69_DDR4 (IC18.D18)
DDR4_2_A1: U_DDR4_SDRAM_PL1 (5 pins), SoC_FPGA_67_68_69_DDR4 (IC18.J16)
DDR4_2_A2: U_DDR4_SDRAM_PL1 (5 pins), SoC_FPGA_67_68_69_DDR4 (IC18.E17)
DDR4_2_A3: U_DDR4_SDRAM_PL1 (5 pins), SoC_FPGA_67_68_69_DDR4 (IC18.K16)
DDR4_2_A4: U_DDR4_SDRAM_PL1 (5 pins), SoC_FPGA_67_68_69_DDR4 (IC18.G18)
DDR4_2_A5: U_DDR4_SDRAM_PL1 (5 pins), SoC_FPGA_67_68_69_DDR4 (IC18.G15)
DDR4_2_A6: U_DDR4_SDRAM_PL1 (5 pins), SoC_FPGA_67_68_69_DDR4 (IC18.E19)
DDR4_2_A7: U_DDR4_SDRAM_PL1 (5 pins), SoC_FPGA_67_68_69_DDR4 (IC18.B17)
DDR4_2_A8: U_DDR4_SDRAM_PL1 (5 pins), SoC_FPGA_67_68_69_DDR4 (IC18.F19)
DDR4_2_A9: U_DDR4_SDRAM_PL1 (5 pins), SoC_FPGA_67_68_69_DDR4 (IC18.E16)
DDR4_2_A10: U_DDR4_SDRAM_PL1 (5 pins), SoC_FPGA_67_68_69_DDR4 (IC18.E18)
DDR4_2_A11: U_DDR4_SDRAM_PL1 (5 pins), SoC_FPGA_67_68_69_DDR4 (IC18.G19)
DDR4_2_A12: U_DDR4_SDRAM_PL1 (5 pins), SoC_FPGA_67_68_69_DDR4 (IC18.F15)
DDR4_2_A13: U_DDR4_SDRAM_PL1 (5 pins), SoC_FPGA_67_68_69_DDR4 (IC18.F16)
DDR4_2_DM0: U_DDR4_SDRAM_PL1 (IC1_U_DDR4_SDRAM_PL1.E7), SoC_FPGA_67_68_69_DDR4 (IC18.F21)
DDR4_2_DM1: U_DDR4_SDRAM_PL1 (IC1_U_DDR4_SDRAM_PL1.E2), SoC_FPGA_67_68_69_DDR4 (IC18.C23)
DDR4_2_DM2: U_DDR4_SDRAM_PL1 (IC2_U_DDR4_SDRAM_PL1.E7), SoC_FPGA_67_68_69_DDR4 (IC18.K13)
DDR4_2_DM3: U_DDR4_SDRAM_PL1 (IC2_U_DDR4_SDRAM_PL1.E2), SoC_FPGA_67_68_69_DDR4 (IC18.J8)
DDR4_2_DM4: U_DDR4_SDRAM_PL1 (IC3_U_DDR4_SDRAM_PL1.E7), SoC_FPGA_67_68_69_DDR4 (IC18.C12)
DDR4_2_DM5: U_DDR4_SDRAM_PL1 (IC3_U_DDR4_SDRAM_PL1.E2), SoC_FPGA_67_68_69_DDR4 (IC18.G13)
DDR4_2_DM6: U_DDR4_SDRAM_PL1 (IC4_U_DDR4_SDRAM_PL1.E7), SoC_FPGA_67_68_69_DDR4 (IC18.J23)
DDR4_2_DM7: U_DDR4_SDRAM_PL1 (IC4_U_DDR4_SDRAM_PL1.E2), SoC_FPGA_67_68_69_DDR4 (IC18.N20)
DDR4_2_DQ0: U_DDR4_SDRAM_PL1 (IC1_U_DDR4_SDRAM_PL1.G2), SoC_FPGA_67_68_69_DDR4 (IC18.E24)
DDR4_2_DQ1: U_DDR4_SDRAM_PL1 (IC1_U_DDR4_SDRAM_PL1.F7), SoC_FPGA_67_68_69_DDR4 (IC18.E21)
DDR4_2_DQ2: U_DDR4_SDRAM_PL1 (IC1_U_DDR4_SDRAM_PL1.H3), SoC_FPGA_67_68_69_DDR4 (IC18.E23)
DDR4_2_DQ3: U_DDR4_SDRAM_PL1 (IC1_U_DDR4_SDRAM_PL1.H7), SoC_FPGA_67_68_69_DDR4 (IC18.D21)
DDR4_2_DQ4: U_DDR4_SDRAM_PL1 (IC1_U_DDR4_SDRAM_PL1.H2), SoC_FPGA_67_68_69_DDR4 (IC18.F24)
DDR4_2_DQ5: U_DDR4_SDRAM_PL1 (IC1_U_DDR4_SDRAM_PL1.H8), SoC_FPGA_67_68_69_DDR4 (IC18.G20)
DDR4_2_DQ6: U_DDR4_SDRAM_PL1 (IC1_U_DDR4_SDRAM_PL1.J3), SoC_FPGA_67_68_69_DDR4 (IC18.E22)
DDR4_2_DQ7: U_DDR4_SDRAM_PL1 (IC1_U_DDR4_SDRAM_PL1.J7), SoC_FPGA_67_68_69_DDR4 (IC18.F20)
DDR4_2_DQ8: U_DDR4_SDRAM_PL1 (IC1_U_DDR4_SDRAM_PL1.A3), SoC_FPGA_67_68_69_DDR4 (IC18.C22)
DDR4_2_DQ9: U_DDR4_SDRAM_PL1 (IC1_U_DDR4_SDRAM_PL1.B8), SoC_FPGA_67_68_69_DDR4 (IC18.A20)
DDR4_2_DQ10: U_DDR4_SDRAM_PL1 (IC1_U_DDR4_SDRAM_PL1.C3), SoC_FPGA_67_68_69_DDR4 (IC18.C21)
DDR4_2_DQ11: U_DDR4_SDRAM_PL1 (IC1_U_DDR4_SDRAM_PL1.C7), SoC_FPGA_67_68_69_DDR4 (IC18.B20)
DDR4_2_DQ12: U_DDR4_SDRAM_PL1 (IC1_U_DDR4_SDRAM_PL1.C2), SoC_FPGA_67_68_69_DDR4 (IC18.B24)
DDR4_2_DQ13: U_DDR4_SDRAM_PL1 (IC1_U_DDR4_SDRAM_PL1.C8), SoC_FPGA_67_68_69_DDR4 (IC18.C20)
DDR4_2_DQ14: U_DDR4_SDRAM_PL1 (IC1_U_DDR4_SDRAM_PL1.D3), SoC_FPGA_67_68_69_DDR4 (IC18.A24)
DDR4_2_DQ15: U_DDR4_SDRAM_PL1 (IC1_U_DDR4_SDRAM_PL1.D7), SoC_FPGA_67_68_69_DDR4 (IC18.A21)
DDR4_2_DQ16: U_DDR4_SDRAM_PL1 (IC2_U_DDR4_SDRAM_PL1.G2), SoC_FPGA_67_68_69_DDR4 (IC18.H10)
DDR4_2_DQ17: U_DDR4_SDRAM_PL1 (IC2_U_DDR4_SDRAM_PL1.F7), SoC_FPGA_67_68_69_DDR4 (IC18.K10)
DDR4_2_DQ18: U_DDR4_SDRAM_PL1 (IC2_U_DDR4_SDRAM_PL1.H3), SoC_FPGA_67_68_69_DDR4 (IC18.J11)
DDR4_2_DQ19: U_DDR4_SDRAM_PL1 (IC2_U_DDR4_SDRAM_PL1.H7), SoC_FPGA_67_68_69_DDR4 (IC18.J10)
DDR4_2_DQ20: U_DDR4_SDRAM_PL1 (IC2_U_DDR4_SDRAM_PL1.H2), SoC_FPGA_67_68_69_DDR4 (IC18.F10)
DDR4_2_DQ21: U_DDR4_SDRAM_PL1 (IC2_U_DDR4_SDRAM_PL1.H8), SoC_FPGA_67_68_69_DDR4 (IC18.K11)
DDR4_2_DQ22: U_DDR4_SDRAM_PL1 (IC2_U_DDR4_SDRAM_PL1.J3), SoC_FPGA_67_68_69_DDR4 (IC18.H11)
DDR4_2_DQ23: U_DDR4_SDRAM_PL1 (IC2_U_DDR4_SDRAM_PL1.J7), SoC_FPGA_67_68_69_DDR4 (IC18.F11)
DDR4_2_DQ24: U_DDR4_SDRAM_PL1 (IC2_U_DDR4_SDRAM_PL1.A3), SoC_FPGA_67_68_69_DDR4 (IC18.K9)
DDR4_2_DQ25: U_DDR4_SDRAM_PL1 (IC2_U_DDR4_SDRAM_PL1.B8), SoC_FPGA_67_68_69_DDR4 (IC18.H6)
DDR4_2_DQ26: U_DDR4_SDRAM_PL1 (IC2_U_DDR4_SDRAM_PL1.C3), SoC_FPGA_67_68_69_DDR4 (IC18.J9)
DDR4_2_DQ27: U_DDR4_SDRAM_PL1 (IC2_U_DDR4_SDRAM_PL1.C7), SoC_FPGA_67_68_69_DDR4 (IC18.H7)
DDR4_2_DQ28: U_DDR4_SDRAM_PL1 (IC2_U_DDR4_SDRAM_PL1.C2), SoC_FPGA_67_68_69_DDR4 (IC18.G9)
DDR4_2_DQ29: U_DDR4_SDRAM_PL1 (IC2_U_DDR4_SDRAM_PL1.C8), SoC_FPGA_67_68_69_DDR4 (IC18.G6)
DDR4_2_DQ30: U_DDR4_SDRAM_PL1 (IC2_U_DDR4_SDRAM_PL1.D3), SoC_FPGA_67_68_69_DDR4 (IC18.F9)
DDR4_2_DQ31: U_DDR4_SDRAM_PL1 (IC2_U_DDR4_SDRAM_PL1.D7), SoC_FPGA_67_68_69_DDR4 (IC18.G7)
DDR4_2_DQ32: U_DDR4_SDRAM_PL1 (IC3_U_DDR4_SDRAM_PL1.G2), SoC_FPGA_67_68_69_DDR4 (IC18.A14)
DDR4_2_DQ33: U_DDR4_SDRAM_PL1 (IC3_U_DDR4_SDRAM_PL1.F7), SoC_FPGA_67_68_69_DDR4 (IC18.D13)
DDR4_2_DQ34: U_DDR4_SDRAM_PL1 (IC3_U_DDR4_SDRAM_PL1.H3), SoC_FPGA_67_68_69_DDR4 (IC18.B13)
DDR4_2_DQ35: U_DDR4_SDRAM_PL1 (IC3_U_DDR4_SDRAM_PL1.H7), SoC_FPGA_67_68_69_DDR4 (IC18.C13)
DDR4_2_DQ36: U_DDR4_SDRAM_PL1 (IC3_U_DDR4_SDRAM_PL1.H2), SoC_FPGA_67_68_69_DDR4 (IC18.B14)
DDR4_2_DQ37: U_DDR4_SDRAM_PL1 (IC3_U_DDR4_SDRAM_PL1.H8), SoC_FPGA_67_68_69_DDR4 (IC18.A11)
DDR4_2_DQ38: U_DDR4_SDRAM_PL1 (IC3_U_DDR4_SDRAM_PL1.J3), SoC_FPGA_67_68_69_DDR4 (IC18.A15)
DDR4_2_DQ39: U_DDR4_SDRAM_PL1 (IC3_U_DDR4_SDRAM_PL1.J7), SoC_FPGA_67_68_69_DDR4 (IC18.A12)
DDR4_2_DQ40: U_DDR4_SDRAM_PL1 (IC3_U_DDR4_SDRAM_PL1.A3), SoC_FPGA_67_68_69_DDR4 (IC18.F14)
DDR4_2_DQ41: U_DDR4_SDRAM_PL1 (IC3_U_DDR4_SDRAM_PL1.B8), SoC_FPGA_67_68_69_DDR4 (IC18.E11)
DDR4_2_DQ42: U_DDR4_SDRAM_PL1 (IC3_U_DDR4_SDRAM_PL1.C3), SoC_FPGA_67_68_69_DDR4 (IC18.G14)
DDR4_2_DQ43: U_DDR4_SDRAM_PL1 (IC3_U_DDR4_SDRAM_PL1.C7), SoC_FPGA_67_68_69_DDR4 (IC18.F12)
DDR4_2_DQ44: U_DDR4_SDRAM_PL1 (IC3_U_DDR4_SDRAM_PL1.C2), SoC_FPGA_67_68_69_DDR4 (IC18.E14)
DDR4_2_DQ45: U_DDR4_SDRAM_PL1 (IC3_U_DDR4_SDRAM_PL1.C8), SoC_FPGA_67_68_69_DDR4 (IC18.H12)
DDR4_2_DQ46: U_DDR4_SDRAM_PL1 (IC3_U_DDR4_SDRAM_PL1.D3), SoC_FPGA_67_68_69_DDR4 (IC18.D14)
DDR4_2_DQ47: U_DDR4_SDRAM_PL1 (IC3_U_DDR4_SDRAM_PL1.D7), SoC_FPGA_67_68_69_DDR4 (IC18.H13)
DDR4_2_DQ48: U_DDR4_SDRAM_PL1 (IC4_U_DDR4_SDRAM_PL1.G2), SoC_FPGA_67_68_69_DDR4 (IC18.G22)
DDR4_2_DQ49: U_DDR4_SDRAM_PL1 (IC4_U_DDR4_SDRAM_PL1.F7), SoC_FPGA_67_68_69_DDR4 (IC18.J21)
DDR4_2_DQ50: U_DDR4_SDRAM_PL1 (IC4_U_DDR4_SDRAM_PL1.H3), SoC_FPGA_67_68_69_DDR4 (IC18.K24)
DDR4_2_DQ51: U_DDR4_SDRAM_PL1 (IC4_U_DDR4_SDRAM_PL1.H7), SoC_FPGA_67_68_69_DDR4 (IC18.H22)
DDR4_2_DQ52: U_DDR4_SDRAM_PL1 (IC4_U_DDR4_SDRAM_PL1.H2), SoC_FPGA_67_68_69_DDR4 (IC18.G23)
DDR4_2_DQ53: U_DDR4_SDRAM_PL1 (IC4_U_DDR4_SDRAM_PL1.H8), SoC_FPGA_67_68_69_DDR4 (IC18.H21)
DDR4_2_DQ54: U_DDR4_SDRAM_PL1 (IC4_U_DDR4_SDRAM_PL1.J3), SoC_FPGA_67_68_69_DDR4 (IC18.L24)
DDR4_2_DQ55: U_DDR4_SDRAM_PL1 (IC4_U_DDR4_SDRAM_PL1.J7), SoC_FPGA_67_68_69_DDR4 (IC18.H23)
DDR4_2_DQ56: U_DDR4_SDRAM_PL1 (IC4_U_DDR4_SDRAM_PL1.A3), SoC_FPGA_67_68_69_DDR4 (IC18.L21)
DDR4_2_DQ57: U_DDR4_SDRAM_PL1 (IC4_U_DDR4_SDRAM_PL1.B8), SoC_FPGA_67_68_69_DDR4 (IC18.N19)
DDR4_2_DQ58: U_DDR4_SDRAM_PL1 (IC4_U_DDR4_SDRAM_PL1.C3), SoC_FPGA_67_68_69_DDR4 (IC18.L20)
DDR4_2_DQ59: U_DDR4_SDRAM_PL1 (IC4_U_DDR4_SDRAM_PL1.C7), SoC_FPGA_67_68_69_DDR4 (IC18.L19)
DDR4_2_DQ60: U_DDR4_SDRAM_PL1 (IC4_U_DDR4_SDRAM_PL1.C2), SoC_FPGA_67_68_69_DDR4 (IC18.L23)
DDR4_2_DQ61: U_DDR4_SDRAM_PL1 (IC4_U_DDR4_SDRAM_PL1.C8), SoC_FPGA_67_68_69_DDR4 (IC18.M19)
DDR4_2_DQ62: U_DDR4_SDRAM_PL1 (IC4_U_DDR4_SDRAM_PL1.D3), SoC_FPGA_67_68_69_DDR4 (IC18.L22)
DDR4_2_DQ63: U_DDR4_SDRAM_PL1 (IC4_U_DDR4_SDRAM_PL1.D7), SoC_FPGA_67_68_69_DDR4 (IC18.M20)
DDR4_A0: U_DDR4_SDRAM_PS (5 pins), SoC_PS_504_DDR4 (IC18.AV31)
DDR4_A1: U_DDR4_SDRAM_PS (5 pins), SoC_PS_504_DDR4 (IC18.AW28)
DDR4_A2: U_DDR4_SDRAM_PS (5 pins), SoC_PS_504_DDR4 (IC18.AV28)
DDR4_A3: U_DDR4_SDRAM_PS (5 pins), SoC_PS_504_DDR4 (IC18.AU29)
DDR4_A4: U_DDR4_SDRAM_PS (5 pins), SoC_PS_504_DDR4 (IC18.AW31)
DDR4_A5: U_DDR4_SDRAM_PS (5 pins), SoC_PS_504_DDR4 (IC18.AU28)
DDR4_A6: U_DDR4_SDRAM_PS (5 pins), SoC_PS_504_DDR4 (IC18.AL29)
DDR4_A7: U_DDR4_SDRAM_PS (5 pins), SoC_PS_504_DDR4 (IC18.AM30)
DDR4_A8: U_DDR4_SDRAM_PS (5 pins), SoC_PS_504_DDR4 (IC18.AM29)
DDR4_A9: U_DDR4_SDRAM_PS (5 pins), SoC_PS_504_DDR4 (IC18.AP29)
DDR4_A10: U_DDR4_SDRAM_PS (5 pins), SoC_PS_504_DDR4 (IC18.AT31)
DDR4_A11: U_DDR4_SDRAM_PS (5 pins), SoC_PS_504_DDR4 (IC18.AT32)
DDR4_A12: U_DDR4_SDRAM_PS (5 pins), SoC_PS_504_DDR4 (IC18.AT30)
DDR4_A13: U_DDR4_SDRAM_PS (5 pins), SoC_PS_504_DDR4 (IC18.AU32)
DDR4_DM0: U_DDR4_SDRAM_PS (IC1_U_DDR4_SDRAM_PS.E7), SoC_PS_504_DDR4 (IC18.AU23)
DDR4_DM1: U_DDR4_SDRAM_PS (IC1_U_DDR4_SDRAM_PS.E2), SoC_PS_504_DDR4 (IC18.AT27)
DDR4_DM2: U_DDR4_SDRAM_PS (IC2_U_DDR4_SDRAM_PS.E7), SoC_PS_504_DDR4 (IC18.AL24)
DDR4_DM3: U_DDR4_SDRAM_PS (IC2_U_DDR4_SDRAM_PS.E2), SoC_PS_504_DDR4 (IC18.AM27)
DDR4_DM4: U_DDR4_SDRAM_PS (IC3_U_DDR4_SDRAM_PS.E7), SoC_PS_504_DDR4 (IC18.AV36)
DDR4_DM5: U_DDR4_SDRAM_PS (IC3_U_DDR4_SDRAM_PS.E2), SoC_PS_504_DDR4 (IC18.AT35)
DDR4_DM6: U_DDR4_SDRAM_PS (IC4_U_DDR4_SDRAM_PS.E7), SoC_PS_504_DDR4 (IC18.AM36)
DDR4_DM7: U_DDR4_SDRAM_PS (IC4_U_DDR4_SDRAM_PS.E2), SoC_PS_504_DDR4 (IC18.AJ32)
DDR4_DQ0: U_DDR4_SDRAM_PS (IC1_U_DDR4_SDRAM_PS.G2), SoC_PS_504_DDR4 (IC18.AW25)
DDR4_DQ1: U_DDR4_SDRAM_PS (IC1_U_DDR4_SDRAM_PS.F7), SoC_PS_504_DDR4 (IC18.AW24)
DDR4_DQ2: U_DDR4_SDRAM_PS (IC1_U_DDR4_SDRAM_PS.H3), SoC_PS_504_DDR4 (IC18.AV25)
DDR4_DQ3: U_DDR4_SDRAM_PS (IC1_U_DDR4_SDRAM_PS.H7), SoC_PS_504_DDR4 (IC18.AW23)
DDR4_DQ4: U_DDR4_SDRAM_PS (IC1_U_DDR4_SDRAM_PS.H2), SoC_PS_504_DDR4 (IC18.AV23)
DDR4_DQ5: U_DDR4_SDRAM_PS (IC1_U_DDR4_SDRAM_PS.H8), SoC_PS_504_DDR4 (IC18.AV22)
DDR4_DQ6: U_DDR4_SDRAM_PS (IC1_U_DDR4_SDRAM_PS.J3), SoC_PS_504_DDR4 (IC18.AR24)
DDR4_DQ7: U_DDR4_SDRAM_PS (IC1_U_DDR4_SDRAM_PS.J7), SoC_PS_504_DDR4 (IC18.AR23)
DDR4_DQ8: U_DDR4_SDRAM_PS (IC1_U_DDR4_SDRAM_PS.A3), SoC_PS_504_DDR4 (IC18.AT25)
DDR4_DQ9: U_DDR4_SDRAM_PS (IC1_U_DDR4_SDRAM_PS.B8), SoC_PS_504_DDR4 (IC18.AP26)
DDR4_DQ10: U_DDR4_SDRAM_PS (IC1_U_DDR4_SDRAM_PS.C3), SoC_PS_504_DDR4 (IC18.AU25)
DDR4_DQ11: U_DDR4_SDRAM_PS (IC1_U_DDR4_SDRAM_PS.C7), SoC_PS_504_DDR4 (IC18.AR27)
DDR4_DQ12: U_DDR4_SDRAM_PS (IC1_U_DDR4_SDRAM_PS.C2), SoC_PS_504_DDR4 (IC18.AU27)
DDR4_DQ13: U_DDR4_SDRAM_PS (IC1_U_DDR4_SDRAM_PS.C8), SoC_PS_504_DDR4 (IC18.AV26)
DDR4_DQ14: U_DDR4_SDRAM_PS (IC1_U_DDR4_SDRAM_PS.D3), SoC_PS_504_DDR4 (IC18.AV27)
DDR4_DQ15: U_DDR4_SDRAM_PS (IC1_U_DDR4_SDRAM_PS.D7), SoC_PS_504_DDR4 (IC18.AW26)
DDR4_DQ16: U_DDR4_SDRAM_PS (IC2_U_DDR4_SDRAM_PS.G2), SoC_PS_504_DDR4 (IC18.AP25)
DDR4_DQ17: U_DDR4_SDRAM_PS (IC2_U_DDR4_SDRAM_PS.F7), SoC_PS_504_DDR4 (IC18.AP24)
DDR4_DQ18: U_DDR4_SDRAM_PS (IC2_U_DDR4_SDRAM_PS.H3), SoC_PS_504_DDR4 (IC18.AP23)
DDR4_DQ19: U_DDR4_SDRAM_PS (IC2_U_DDR4_SDRAM_PS.H7), SoC_PS_504_DDR4 (IC18.AN25)
DDR4_DQ20: U_DDR4_SDRAM_PS (IC2_U_DDR4_SDRAM_PS.H2), SoC_PS_504_DDR4 (IC18.AM25)
DDR4_DQ21: U_DDR4_SDRAM_PS (IC2_U_DDR4_SDRAM_PS.H8), SoC_PS_504_DDR4 (IC18.AK24)
DDR4_DQ22: U_DDR4_SDRAM_PS (IC2_U_DDR4_SDRAM_PS.J3), SoC_PS_504_DDR4 (IC18.AN23)
DDR4_DQ23: U_DDR4_SDRAM_PS (IC2_U_DDR4_SDRAM_PS.J7), SoC_PS_504_DDR4 (IC18.AK23)
DDR4_DQ24: U_DDR4_SDRAM_PS (IC2_U_DDR4_SDRAM_PS.A3), SoC_PS_504_DDR4 (IC18.AK26)
DDR4_DQ25: U_DDR4_SDRAM_PS (IC2_U_DDR4_SDRAM_PS.B8), SoC_PS_504_DDR4 (IC18.AL25)
DDR4_DQ26: U_DDR4_SDRAM_PS (IC2_U_DDR4_SDRAM_PS.C3), SoC_PS_504_DDR4 (IC18.AK28)
DDR4_DQ27: U_DDR4_SDRAM_PS (IC2_U_DDR4_SDRAM_PS.C7), SoC_PS_504_DDR4 (IC18.AK27)
DDR4_DQ28: U_DDR4_SDRAM_PS (IC2_U_DDR4_SDRAM_PS.C2), SoC_PS_504_DDR4 (IC18.AN27)
DDR4_DQ29: U_DDR4_SDRAM_PS (IC2_U_DDR4_SDRAM_PS.C8), SoC_PS_504_DDR4 (IC18.AN26)
DDR4_DQ30: U_DDR4_SDRAM_PS (IC2_U_DDR4_SDRAM_PS.D3), SoC_PS_504_DDR4 (IC18.AN28)
DDR4_DQ31: U_DDR4_SDRAM_PS (IC2_U_DDR4_SDRAM_PS.D7), SoC_PS_504_DDR4 (IC18.AM28)
DDR4_DQ32: U_DDR4_SDRAM_PS (IC3_U_DDR4_SDRAM_PS.G2), SoC_PS_504_DDR4 (IC18.AU39)
DDR4_DQ33: U_DDR4_SDRAM_PS (IC3_U_DDR4_SDRAM_PS.F7), SoC_PS_504_DDR4 (IC18.AU38)
DDR4_DQ34: U_DDR4_SDRAM_PS (IC3_U_DDR4_SDRAM_PS.H3), SoC_PS_504_DDR4 (IC18.AU37)
DDR4_DQ35: U_DDR4_SDRAM_PS (IC3_U_DDR4_SDRAM_PS.H7), SoC_PS_504_DDR4 (IC18.AU35)
DDR4_DQ36: U_DDR4_SDRAM_PS (IC3_U_DDR4_SDRAM_PS.H2), SoC_PS_504_DDR4 (IC18.AV38)
DDR4_DQ37: U_DDR4_SDRAM_PS (IC3_U_DDR4_SDRAM_PS.H8), SoC_PS_504_DDR4 (IC18.AW36)
DDR4_DQ38: U_DDR4_SDRAM_PS (IC3_U_DDR4_SDRAM_PS.J3), SoC_PS_504_DDR4 (IC18.AV35)
DDR4_DQ39: U_DDR4_SDRAM_PS (IC3_U_DDR4_SDRAM_PS.J7), SoC_PS_504_DDR4 (IC18.AW35)
DDR4_DQ40: U_DDR4_SDRAM_PS (IC3_U_DDR4_SDRAM_PS.A3), SoC_PS_504_DDR4 (IC18.AU33)
DDR4_DQ41: U_DDR4_SDRAM_PS (IC3_U_DDR4_SDRAM_PS.B8), SoC_PS_504_DDR4 (IC18.AV33)
DDR4_DQ42: U_DDR4_SDRAM_PS (IC3_U_DDR4_SDRAM_PS.C3), SoC_PS_504_DDR4 (IC18.AW34)
DDR4_DQ43: U_DDR4_SDRAM_PS (IC3_U_DDR4_SDRAM_PS.C7), SoC_PS_504_DDR4 (IC18.AW33)
DDR4_DQ44: U_DDR4_SDRAM_PS (IC3_U_DDR4_SDRAM_PS.C2), SoC_PS_504_DDR4 (IC18.AR34)
DDR4_DQ45: U_DDR4_SDRAM_PS (IC3_U_DDR4_SDRAM_PS.C8), SoC_PS_504_DDR4 (IC18.AR33)
DDR4_DQ46: U_DDR4_SDRAM_PS (IC3_U_DDR4_SDRAM_PS.D3), SoC_PS_504_DDR4 (IC18.AP33)
DDR4_DQ47: U_DDR4_SDRAM_PS (IC3_U_DDR4_SDRAM_PS.D7), SoC_PS_504_DDR4 (IC18.AP34)
DDR4_DQ48: U_DDR4_SDRAM_PS (IC4_U_DDR4_SDRAM_PS.G2), SoC_PS_504_DDR4 (IC18.AL39)
DDR4_DQ49: U_DDR4_SDRAM_PS (IC4_U_DDR4_SDRAM_PS.F7), SoC_PS_504_DDR4 (IC18.AM38)
DDR4_DQ50: U_DDR4_SDRAM_PS (IC4_U_DDR4_SDRAM_PS.H3), SoC_PS_504_DDR4 (IC18.AM39)
DDR4_DQ51: U_DDR4_SDRAM_PS (IC4_U_DDR4_SDRAM_PS.H7), SoC_PS_504_DDR4 (IC18.AN38)
DDR4_DQ52: U_DDR4_SDRAM_PS (IC4_U_DDR4_SDRAM_PS.H2), SoC_PS_504_DDR4 (IC18.AM35)
DDR4_DQ53: U_DDR4_SDRAM_PS (IC4_U_DDR4_SDRAM_PS.H8), SoC_PS_504_DDR4 (IC18.AM34)
DDR4_DQ54: U_DDR4_SDRAM_PS (IC4_U_DDR4_SDRAM_PS.J3), SoC_PS_504_DDR4 (IC18.AN36)
DDR4_DQ55: U_DDR4_SDRAM_PS (IC4_U_DDR4_SDRAM_PS.J7), SoC_PS_504_DDR4 (IC18.AN35)
DDR4_DQ56: U_DDR4_SDRAM_PS (IC4_U_DDR4_SDRAM_PS.A3), SoC_PS_504_DDR4 (IC18.AK32)
DDR4_DQ57: U_DDR4_SDRAM_PS (IC4_U_DDR4_SDRAM_PS.B8), SoC_PS_504_DDR4 (IC18.AK31)
DDR4_DQ58: U_DDR4_SDRAM_PS (IC4_U_DDR4_SDRAM_PS.C3), SoC_PS_504_DDR4 (IC18.AJ31)
DDR4_DQ59: U_DDR4_SDRAM_PS (IC4_U_DDR4_SDRAM_PS.C7), SoC_PS_504_DDR4 (IC18.AJ30)
DDR4_DQ60: U_DDR4_SDRAM_PS (IC4_U_DDR4_SDRAM_PS.C2), SoC_PS_504_DDR4 (IC18.AH30)
DDR4_DQ61: U_DDR4_SDRAM_PS (IC4_U_DDR4_SDRAM_PS.C8), SoC_PS_504_DDR4 (IC18.AG32)
DDR4_DQ62: U_DDR4_SDRAM_PS (IC4_U_DDR4_SDRAM_PS.D3), SoC_PS_504_DDR4 (IC18.AF32)
DDR4_DQ63: U_DDR4_SDRAM_PS (IC4_U_DDR4_SDRAM_PS.D7), SoC_PS_504_DDR4 (IC18.AG30)
DDR4_PL0.DDR4_A14_WE_B: U_DDR4_SDRAM_PL1 (5 pins), SoC_FPGA_67_68_69_DDR4 (IC18.K18)
DDR4_PL0.DDR4_A15_CAS_B: U_DDR4_SDRAM_PL1 (5 pins), SoC_FPGA_67_68_69_DDR4 (IC18.C16)
DDR4_PL0.DDR4_A16_RAS_B: U_DDR4_SDRAM_PL1 (5 pins), SoC_FPGA_67_68_69_DDR4 (IC18.D15)
DDR4_PL0.DDR4_ACT_B: U_DDR4_SDRAM_PL1 (5 pins), SoC_FPGA_67_68_69_DDR4 (IC18.B19)
DDR4_PL0.DDR4_ALERT_B: U_DDR4_SDRAM_PL1 (5 pins), SoC_FPGA_67_68_69_DDR4 (IC18.A17)
DDR4_PL0.DDR4_BA0: U_DDR4_SDRAM_PL1 (5 pins), SoC_FPGA_67_68_69_DDR4 (IC18.A19)
DDR4_PL0.DDR4_BA1: U_DDR4_SDRAM_PL1 (5 pins), SoC_FPGA_67_68_69_DDR4 (IC18.D16)
DDR4_PL0.DDR4_BG0: U_DDR4_SDRAM_PL1 (5 pins), SoC_FPGA_67_68_69_DDR4 (IC18.K19)
DDR4_PL0.DDR4_CK_N: U_DDR4_SDRAM_PL1 (5 pins), SoC_FPGA_67_68_69_DDR4 (IC18.F17)
DDR4_PL0.DDR4_CK_P: U_DDR4_SDRAM_PL1 (5 pins), SoC_FPGA_67_68_69_DDR4 (IC18.G17)
DDR4_PL0.DDR4_CKE: U_DDR4_SDRAM_PL1 (5 pins), SoC_FPGA_67_68_69_DDR4 (IC18.H18)
DDR4_PL0.DDR4_CS_B: U_DDR4_SDRAM_PL1 (5 pins), SoC_FPGA_67_68_69_DDR4 (IC18.A16)
DDR4_PL0.DDR4_DQS0_N: U_DDR4_SDRAM_PL1 (IC1_U_DDR4_SDRAM_PL1.F3), SoC_FPGA_67_68_69_DDR4 (IC18.D24)
DDR4_PL0.DDR4_DQS0_P: U_DDR4_SDRAM_PL1 (IC1_U_DDR4_SDRAM_PL1.G3), SoC_FPGA_67_68_69_DDR4 (IC18.D23)
DDR4_PL0.DDR4_DQS1_N: U_DDR4_SDRAM_PL1 (IC1_U_DDR4_SDRAM_PL1.A7), SoC_FPGA_67_68_69_DDR4 (IC18.A22)
DDR4_PL0.DDR4_DQS1_P: U_DDR4_SDRAM_PL1 (IC1_U_DDR4_SDRAM_PL1.B7), SoC_FPGA_67_68_69_DDR4 (IC18.B22)
DDR4_PL0.DDR4_DQS2_N: U_DDR4_SDRAM_PL1 (IC2_U_DDR4_SDRAM_PL1.F3), SoC_FPGA_67_68_69_DDR4 (IC18.J13)
DDR4_PL0.DDR4_DQS2_P: U_DDR4_SDRAM_PL1 (IC2_U_DDR4_SDRAM_PL1.G3), SoC_FPGA_67_68_69_DDR4 (IC18.J14)
DDR4_PL0.DDR4_DQS3_N: U_DDR4_SDRAM_PL1 (IC2_U_DDR4_SDRAM_PL1.A7), SoC_FPGA_67_68_69_DDR4 (IC18.G8)
DDR4_PL0.DDR4_DQS3_P: U_DDR4_SDRAM_PL1 (IC2_U_DDR4_SDRAM_PL1.B7), SoC_FPGA_67_68_69_DDR4 (IC18.H8)
DDR4_PL0.DDR4_DQS4_N: U_DDR4_SDRAM_PL1 (IC3_U_DDR4_SDRAM_PL1.F3), SoC_FPGA_67_68_69_DDR4 (IC18.B15)
DDR4_PL0.DDR4_DQS4_P: U_DDR4_SDRAM_PL1 (IC3_U_DDR4_SDRAM_PL1.G3), SoC_FPGA_67_68_69_DDR4 (IC18.C15)
DDR4_PL0.DDR4_DQS5_N: U_DDR4_SDRAM_PL1 (IC3_U_DDR4_SDRAM_PL1.A7), SoC_FPGA_67_68_69_DDR4 (IC18.E12)
DDR4_PL0.DDR4_DQS5_P: U_DDR4_SDRAM_PL1 (IC3_U_DDR4_SDRAM_PL1.B7), SoC_FPGA_67_68_69_DDR4 (IC18.E13)
DDR4_PL0.DDR4_DQS6_N: U_DDR4_SDRAM_PL1 (IC4_U_DDR4_SDRAM_PL1.F3), SoC_FPGA_67_68_69_DDR4 (IC18.H20)
DDR4_PL0.DDR4_DQS6_P: U_DDR4_SDRAM_PL1 (IC4_U_DDR4_SDRAM_PL1.G3), SoC_FPGA_67_68_69_DDR4 (IC18.J20)
DDR4_PL0.DDR4_DQS7_N: U_DDR4_SDRAM_PL1 (IC4_U_DDR4_SDRAM_PL1.A7), SoC_FPGA_67_68_69_DDR4 (IC18.K22)
DDR4_PL0.DDR4_DQS7_P: U_DDR4_SDRAM_PL1 (IC4_U_DDR4_SDRAM_PL1.B7), SoC_FPGA_67_68_69_DDR4 (IC18.K21)
DDR4_PL0.DDR4_ODT: U_DDR4_SDRAM_PL1 (5 pins), SoC_FPGA_67_68_69_DDR4 (IC18.D19)
DDR4_PL0.DDR4_PAR: U_DDR4_SDRAM_PL1 (5 pins), SoC_FPGA_67_68_69_DDR4 (IC18.B18)
DDR4_PL0.DDR4_RESET_B: U_DDR4_SDRAM_PL1 (5 pins), SoC_FPGA_67_68_69_DDR4 (IC18.C18)
DDR4_PL1.DDR4_A14_WE_B: U_DDR4_SDRAM_PL2 (5 pins), SoC_FPGA_64_65_66_DDR4 (IC18.AG17)
DDR4_PL1.DDR4_A15_CAS_B: U_DDR4_SDRAM_PL2 (5 pins), SoC_FPGA_64_65_66_DDR4 (IC18.AH16)
DDR4_PL1.DDR4_A16_RAS_B: U_DDR4_SDRAM_PL2 (5 pins), SoC_FPGA_64_65_66_DDR4 (IC18.AK16)
DDR4_PL1.DDR4_ACT_B: U_DDR4_SDRAM_PL2 (5 pins), SoC_FPGA_64_65_66_DDR4 (IC18.AF16)
DDR4_PL1.DDR4_ALERT_B: U_DDR4_SDRAM_PL2 (5 pins), SoC_FPGA_64_65_66_DDR4 (IC18.AH15)
DDR4_PL1.DDR4_BA0: U_DDR4_SDRAM_PL2 (5 pins), SoC_FPGA_64_65_66_DDR4 (IC18.AF15)
DDR4_PL1.DDR4_BA1: U_DDR4_SDRAM_PL2 (5 pins), SoC_FPGA_64_65_66_DDR4 (IC18.AP15)
DDR4_PL1.DDR4_BG0: U_DDR4_SDRAM_PL2 (5 pins), SoC_FPGA_64_65_66_DDR4 (IC18.AH17)
DDR4_PL1.DDR4_CK_N: U_DDR4_SDRAM_PL2 (5 pins), SoC_FPGA_64_65_66_DDR4 (IC18.AW13)
DDR4_PL1.DDR4_CK_P: U_DDR4_SDRAM_PL2 (5 pins), SoC_FPGA_64_65_66_DDR4 (IC18.AW14)
DDR4_PL1.DDR4_CKE: U_DDR4_SDRAM_PL2 (5 pins), SoC_FPGA_64_65_66_DDR4 (IC18.AF17)
DDR4_PL1.DDR4_CS_B: U_DDR4_SDRAM_PL2 (5 pins), SoC_FPGA_64_65_66_DDR4 (IC18.AJ15)
DDR4_PL1.DDR4_DQS0_N: U_DDR4_SDRAM_PL2 (IC1_U_DDR4_SDRAM_PL2.F3), SoC_FPGA_64_65_66_DDR4 (IC18.AN13)
DDR4_PL1.DDR4_DQS0_P: U_DDR4_SDRAM_PL2 (IC1_U_DDR4_SDRAM_PL2.G3), SoC_FPGA_64_65_66_DDR4 (IC18.AM13)
DDR4_PL1.DDR4_DQS1_N: U_DDR4_SDRAM_PL2 (IC1_U_DDR4_SDRAM_PL2.A7), SoC_FPGA_64_65_66_DDR4 (IC18.AK14)
DDR4_PL1.DDR4_DQS1_P: U_DDR4_SDRAM_PL2 (IC1_U_DDR4_SDRAM_PL2.B7), SoC_FPGA_64_65_66_DDR4 (IC18.AJ14)
DDR4_PL1.DDR4_DQS2_N: U_DDR4_SDRAM_PL2 (IC2_U_DDR4_SDRAM_PL2.F3), SoC_FPGA_64_65_66_DDR4 (IC18.AT11)
DDR4_PL1.DDR4_DQS2_P: U_DDR4_SDRAM_PL2 (IC2_U_DDR4_SDRAM_PL2.G3), SoC_FPGA_64_65_66_DDR4 (IC18.AT12)
DDR4_PL1.DDR4_DQS3_N: U_DDR4_SDRAM_PL2 (IC2_U_DDR4_SDRAM_PL2.A7), SoC_FPGA_64_65_66_DDR4 (IC18.AN7)
DDR4_PL1.DDR4_DQS3_P: U_DDR4_SDRAM_PL2 (IC2_U_DDR4_SDRAM_PL2.B7), SoC_FPGA_64_65_66_DDR4 (IC18.AN8)
DDR4_PL1.DDR4_DQS4_N: U_DDR4_SDRAM_PL2 (IC3_U_DDR4_SDRAM_PL2.F3), SoC_FPGA_64_65_66_DDR4 (IC18.AM22)
DDR4_PL1.DDR4_DQS4_P: U_DDR4_SDRAM_PL2 (IC3_U_DDR4_SDRAM_PL2.G3), SoC_FPGA_64_65_66_DDR4 (IC18.AL22)
DDR4_PL1.DDR4_DQS5_N: U_DDR4_SDRAM_PL2 (IC3_U_DDR4_SDRAM_PL2.A7), SoC_FPGA_64_65_66_DDR4 (IC18.AH20)
DDR4_PL1.DDR4_DQS5_P: U_DDR4_SDRAM_PL2 (IC3_U_DDR4_SDRAM_PL2.B7), SoC_FPGA_64_65_66_DDR4 (IC18.AG20)
DDR4_PL1.DDR4_DQS6_N: U_DDR4_SDRAM_PL2 (IC4_U_DDR4_SDRAM_PL2.F3), SoC_FPGA_64_65_66_DDR4 (IC18.AW21)
DDR4_PL1.DDR4_DQS6_P: U_DDR4_SDRAM_PL2 (IC4_U_DDR4_SDRAM_PL2.G3), SoC_FPGA_64_65_66_DDR4 (IC18.AV21)
DDR4_PL1.DDR4_DQS7_N: U_DDR4_SDRAM_PL2 (IC4_U_DDR4_SDRAM_PL2.A7), SoC_FPGA_64_65_66_DDR4 (IC18.AT22)
DDR4_PL1.DDR4_DQS7_P: U_DDR4_SDRAM_PL2 (IC4_U_DDR4_SDRAM_PL2.B7), SoC_FPGA_64_65_66_DDR4 (IC18.AR22)
DDR4_PL1.DDR4_ODT: U_DDR4_SDRAM_PL2 (5 pins), SoC_FPGA_64_65_66_DDR4 (IC18.AJ16)
DDR4_PL1.DDR4_PAR: U_DDR4_SDRAM_PL2 (5 pins), SoC_FPGA_64_65_66_DDR4 (IC18.AL16)
DDR4_PL1.DDR4_RESET_B: U_DDR4_SDRAM_PL2 (5 pins), SoC_FPGA_64_65_66_DDR4 (IC18.AL12)
DDR4_PS.DDR4_A14_WE_B: U_DDR4_SDRAM_PS (5 pins), SoC_PS_504_DDR4 (IC18.AR28)
DDR4_PS.DDR4_A15_CAS_B: U_DDR4_SDRAM_PS (5 pins), SoC_PS_504_DDR4 (IC18.AP30)
DDR4_PS.DDR4_A16_RAS_B: U_DDR4_SDRAM_PS (5 pins), SoC_PS_504_DDR4 (IC18.AP28)
DDR4_PS.DDR4_ACT_B: U_DDR4_SDRAM_PS (5 pins), SoC_PS_504_DDR4 (IC18.AL30)
DDR4_PS.DDR4_ALERT_B: U_DDR4_SDRAM_PS (5 pins), SoC_PS_504_DDR4 (IC18.AL32)
DDR4_PS.DDR4_BA0: U_DDR4_SDRAM_PS (5 pins), SoC_PS_504_DDR4 (IC18.AN30)
DDR4_PS.DDR4_BA1: U_DDR4_SDRAM_PS (5 pins), SoC_PS_504_DDR4 (IC18.AM32)
DDR4_PS.DDR4_BG0: U_DDR4_SDRAM_PS (5 pins), SoC_PS_504_DDR4 (IC18.AN32)
DDR4_PS.DDR4_CK_N: U_DDR4_SDRAM_PS (5 pins), SoC_PS_504_DDR4 (IC18.AV30)
DDR4_PS.DDR4_CK_P: U_DDR4_SDRAM_PS (5 pins), SoC_PS_504_DDR4 (IC18.AU30)
DDR4_PS.DDR4_CKE: U_DDR4_SDRAM_PS (5 pins), SoC_PS_504_DDR4 (IC18.AW30)
DDR4_PS.DDR4_CS_B: U_DDR4_SDRAM_PS (5 pins), SoC_PS_504_DDR4 (IC18.AW29)
DDR4_PS.DDR4_DQS0_N: U_DDR4_SDRAM_PS (IC1_U_DDR4_SDRAM_PS.F3), SoC_PS_504_DDR4 (IC18.AU24)
DDR4_PS.DDR4_DQS0_P: U_DDR4_SDRAM_PS (IC1_U_DDR4_SDRAM_PS.G3), SoC_PS_504_DDR4 (IC18.AT24)
DDR4_PS.DDR4_DQS1_N: U_DDR4_SDRAM_PS (IC1_U_DDR4_SDRAM_PS.A7), SoC_PS_504_DDR4 (IC18.AT26)
DDR4_PS.DDR4_DQS1_P: U_DDR4_SDRAM_PS (IC1_U_DDR4_SDRAM_PS.B7), SoC_PS_504_DDR4 (IC18.AR26)
DDR4_PS.DDR4_DQS2_N: U_DDR4_SDRAM_PS (IC2_U_DDR4_SDRAM_PS.F3), SoC_PS_504_DDR4 (IC18.AM24)
DDR4_PS.DDR4_DQS2_P: U_DDR4_SDRAM_PS (IC2_U_DDR4_SDRAM_PS.G3), SoC_PS_504_DDR4 (IC18.AM23)
DDR4_PS.DDR4_DQS3_N: U_DDR4_SDRAM_PS (IC2_U_DDR4_SDRAM_PS.A7), SoC_PS_504_DDR4 (IC18.AL27)
DDR4_PS.DDR4_DQS3_P: U_DDR4_SDRAM_PS (IC2_U_DDR4_SDRAM_PS.B7), SoC_PS_504_DDR4 (IC18.AL26)
DDR4_PS.DDR4_DQS4_N: U_DDR4_SDRAM_PS (IC3_U_DDR4_SDRAM_PS.F3), SoC_PS_504_DDR4 (IC18.AW37)
DDR4_PS.DDR4_DQS4_P: U_DDR4_SDRAM_PS (IC3_U_DDR4_SDRAM_PS.G3), SoC_PS_504_DDR4 (IC18.AV37)
DDR4_PS.DDR4_DQS5_N: U_DDR4_SDRAM_PS (IC3_U_DDR4_SDRAM_PS.A7), SoC_PS_504_DDR4 (IC18.AU34)
DDR4_PS.DDR4_DQS5_P: U_DDR4_SDRAM_PS (IC3_U_DDR4_SDRAM_PS.B7), SoC_PS_504_DDR4 (IC18.AT34)
DDR4_PS.DDR4_DQS6_N: U_DDR4_SDRAM_PS (IC4_U_DDR4_SDRAM_PS.F3), SoC_PS_504_DDR4 (IC18.AN37)
DDR4_PS.DDR4_DQS6_P: U_DDR4_SDRAM_PS (IC4_U_DDR4_SDRAM_PS.G3), SoC_PS_504_DDR4 (IC18.AM37)
DDR4_PS.DDR4_DQS7_N: U_DDR4_SDRAM_PS (IC4_U_DDR4_SDRAM_PS.A7), SoC_PS_504_DDR4 (IC18.AH32)
DDR4_PS.DDR4_DQS7_P: U_DDR4_SDRAM_PS (IC4_U_DDR4_SDRAM_PS.B7), SoC_PS_504_DDR4 (IC18.AH31)
DDR4_PS.DDR4_ODT: U_DDR4_SDRAM_PS (5 pins), SoC_PS_504_DDR4 (IC18.AV32)
DDR4_PS.DDR4_PAR: U_DDR4_SDRAM_PS (5 pins), SoC_PS_504_DDR4 (IC18.AN31)
DDR4_PS.DDR4_RESET_B: U_DDR4_SDRAM_PS (5 pins), SoC_PS_504_DDR4 (IC18.AM33)
DXN: Thermometers (R608.1), SoC_FPGA_Config_0 (IC18.AA16)
DXP: Thermometers (C810.2 C811.2 IC65.3), SoC_FPGA_Config_0 (IC18.AA17)
EEPROM_WP: CPU_LPC1776_1 (IC24.N13), Thermometers (IC27.7 R516#1.2)
EN_DAC_AVCC: CPU_LPC1776_1 (IC78.5), ADC_DAC_Supply (IC17.7 IC19.7 IC20.7 R412.2)
EN_FLASH_UPDATE: CPU_LPC1776_1 (IC24.J4), SoC_PS_500_501_502_MIO (IC57.1 IC59.1 R547.2)
EN_MGT1V2: CPU_LPC1776_1 (IC78.11), Supply (IC13.J6 IC13.K7 R421.2)
EN_MGT1V8: CPU_LPC1776_1 (IC78.13), Supply_LDOs (IC15.7 R385.2)
EN_MGTAVCC: CPU_LPC1776_1 (IC78.6), Supply (IC12.K7 R419.2)
EN_MGTRAVCC: CPU_LPC1776_1 (IC78.7), Supply_LDOs (IC16.7 R386.2)
EN_P1V0: CPU_LPC1776_1 (IC78.8), Supply (IC12.J6 R417.2)
EN_P1V2: CPU_LPC1776_1 (IC78.12), Supply (IC11.J6 IC11.K7 R418.2)
EN_P1V8: CPU_LPC1776_1 (IC78.14), Supply (IC11.F6 R415.2)
EN_P1V13: CPU_LPC1776_1 (IC78.10), Supply (IC12.F6 R416.2)
EN_P3V3: CPU_LPC1776_1 (IC78.15), Supply (IC11.C6 R413.2)
EN_P3V5: CPU_LPC1776_1 (IC78.4), Supply (IC12.C6 R414.2)
EN_P5V0: CPU_LPC1776_1 (IC78.3), Power_Management_RFMC_RTM (IC41.A3 R455.2)
EN_RTM_MP: CPU_LPC1776_1 (IC78.16), Power_Management_RFMC_RTM (R394.2 T6.1)
EN_RTM_PWR: CPU_LPC1776_1 (IC78.17), Power_Management_RFMC_RTM (R391.2 T5.1)
EN_USB_JTAG: USB_SERIAL_QUAD (T18.1), JTAG_Configuration (5 pins)
EN_VCCINT_AMS: CPU_LPC1776_1 (IC78.2), Supply (IC13.C6 IC13.F6 R420.2)
EN_VCCINT_IO: CPU_LPC1776_1 (IC78.1), VCCINT_IO_BRAM_PS (5 pins)
ERR_OUT: CPU_LPC1776_1 (IC24.P14), SoC_PS_Config_503 (IC18.AF30 R604.1 T16.1)
ERR_STAT: CPU_LPC1776_1 (IC24.M14), SoC_PS_Config_503 (IC18.AC32 R606.1 T17.1)
FCLKA_N: AMC_Connector (P1.81), SoC_FPGA_128-131_GTY (C552.1)
FCLKA_P: AMC_Connector (P1.80), SoC_FPGA_128-131_GTY (C1006.1)
FLASH_UPD_CLK: CPU_LPC1776_1 (IC24.K6), SoC_PS_500_501_502_MIO (IC76.4)
FLASH_UPD_CSB: CPU_LPC1776_1 (IC24.N6), SoC_PS_500_501_502_MIO (IC76.5)
FLASH_UPD_MISO: CPU_LPC1776_1 (IC24.N7), SoC_PS_500_501_502_MIO (IC56.4)
FLASH_UPD_MOSI: CPU_LPC1776_1 (IC24.P7), SoC_PS_500_501_502_MIO (IC56.5)
FPGA_I2C_SCL: CPU_LPC1776_1 (R199.1), I2C_MUX (B13.1 IC30.19 R301.1), SoC_PS_500_501_502_MIO (IC54.8)
FPGA_I2C_SDA: CPU_LPC1776_1 (R198.1), I2C_MUX (B12.1 IC30.20 R300.1), SoC_PS_500_501_502_MIO (IC54.1)
FPGA_REFCLK_OUT_C_N: AMS_CLOCK (C126.2), FPGA_7A35T (IC84.D14 R682.2)
FPGA_REFCLK_OUT_C_P: AMS_CLOCK (C125.2), FPGA_7A35T (IC84.E13 R683.2)
FPGA_SDRAM0_CLK_N: SoC_FPGA_67_68_69_DDR4 (IC18.J18 R438.1 R535.2), Clocking_SI5341B (C735.2)
FPGA_SDRAM0_CLK_P: SoC_FPGA_67_68_69_DDR4 (IC18.J19 R437.1 R535.1), Clocking_SI5341B (C734.2)
FPGA_SDRAM1_CLK_N: SoC_FPGA_64_65_66_DDR4 (IC18.AM17 R433.1 R528.2), Clocking_SI5341B (C738.2)
FPGA_SDRAM1_CLK_P: SoC_FPGA_64_65_66_DDR4 (IC18.AL17 R432.1 R528.1), Clocking_SI5341B (C736.2)
FPGA_STATUS: CPU_LPC1776_1 (IC24.M5), SoC_FPGA_HD_84_87 (IC18.AP5)
FPGA_SYSREF_N: AMS_CLOCK (C107.2), SoC_FPGA_67_68_69_DDR4 (IC18.H16 R436.1 R536.2)
FPGA_SYSREF_P: AMS_CLOCK (C94.2), SoC_FPGA_67_68_69_DDR4 (IC18.H17 R435.1 R536.1)
FPGA_TCK: SoC_PS_Config_503 (IC18.AA29), JTAG_Configuration (IC35.17 R359.1 R375.1)
FPGA_TDI: SoC_PS_Config_503 (IC18.AD31), JTAG_Configuration (IC35.18 R374.1)
FPGA_TDO: SoC_PS_Config_503 (IC18.AD32), JTAG_Configuration (R50.2 R373.1)
FPGA_TMS: SoC_PS_Config_503 (IC18.AD30), JTAG_Configuration (IC35.11 R360.1 R376.1)
GA0: AMC_Connector (P1.5), CPU_LPC1776_1 (D9.1 R204.1 R207.1)
GA1: AMC_Connector (P1.17), CPU_LPC1776_1 (D8.1 R205.1 R208.1)
GA2: AMC_Connector (P1.26), CPU_LPC1776_1 (D7.1 R206.1 R209.1)
GTP0-3_CLK_IN_N: RTM_Connector (J5.b9), SoC_PS_505_GTR (C928.2)
GTP0-3_CLK_IN_P: RTM_Connector (J5.a9), SoC_PS_505_GTR (C927.2)
GTP0-3_CLK_OUT_N: RTM_Connector (J5.b10), SoC_PS_505_GTR (IC38.2)
GTP0-3_CLK_OUT_P: RTM_Connector (J5.a10), SoC_PS_505_GTR (IC38.1)
GTP0RX_N: RTM_Connector (J5.d10), SoC_PS_505_GTR (C926.2)
GTP0RX_P: RTM_Connector (J5.c10), SoC_PS_505_GTR (C925.2)
GTP0TX_N: RTM_Connector (J5.f10), SoC_PS_505_GTR (C924.2)
GTP0TX_P: RTM_Connector (J5.e10), SoC_PS_505_GTR (C923.2)
GTP1RX_N: RTM_Connector (J5.d9), SoC_PS_505_GTR (C790.2)
GTP1RX_P: RTM_Connector (J5.c9), SoC_PS_505_GTR (C789.2)
GTP1TX_N: RTM_Connector (J5.f9), SoC_PS_505_GTR (C788.2)
GTP1TX_P: RTM_Connector (J5.e9), SoC_PS_505_GTR (C787.2)
GTP2RX_N: RTM_Connector (J5.d8), SoC_PS_505_GTR (C794.2)
GTP2RX_P: RTM_Connector (J5.c8), SoC_PS_505_GTR (C793.2)
GTP2TX_N: RTM_Connector (J5.f8), SoC_PS_505_GTR (C792.2)
GTP2TX_P: RTM_Connector (J5.e8), SoC_PS_505_GTR (C791.2)
GTP3RX_N: RTM_Connector (J5.d7), SoC_PS_505_GTR (C798.2)
GTP3RX_P: RTM_Connector (J5.c7), SoC_PS_505_GTR (C797.2)
GTP3TX_N: RTM_Connector (J5.f7), SoC_PS_505_GTR (C796.2)
GTP3TX_P: RTM_Connector (J5.e7), SoC_PS_505_GTR (C795.2)
GTP4-7_CLK_IN_N: RTM_Connector (J5.b5), SoC_FPGA_128-131_GTY (C801.2)
GTP4-7_CLK_IN_P: RTM_Connector (J5.a5), SoC_FPGA_128-131_GTY (C863.2)
GTP4-7_CLK_OUT_N: RTM_Connector (J5.b6), SoC_FPGA_128-131_GTY (IC29.2)
GTP4-7_CLK_OUT_P: RTM_Connector (J5.a6), SoC_FPGA_128-131_GTY (IC29.1)
GTP4RX_N: RTM_Connector (J5.d6), SoC_FPGA_128-131_GTY (C507.2)
GTP4RX_P: RTM_Connector (J5.c6), SoC_FPGA_128-131_GTY (C510.2)
GTP4TX_N: RTM_Connector (J5.f6), SoC_FPGA_128-131_GTY (C513.2)
GTP4TX_P: RTM_Connector (J5.e6), SoC_FPGA_128-131_GTY (C514.2)
GTP5RX_N: RTM_Connector (J5.d5), SoC_FPGA_128-131_GTY (C503.2)
GTP5RX_P: RTM_Connector (J5.c5), SoC_FPGA_128-131_GTY (C504.2)
GTP5TX_N: RTM_Connector (J5.f5), SoC_FPGA_128-131_GTY (C505.2)
GTP5TX_P: RTM_Connector (J5.e5), SoC_FPGA_128-131_GTY (C506.2)
GTP6RX_N: RTM_Connector (J5.d4), SoC_FPGA_128-131_GTY (C499.2)
GTP6RX_P: RTM_Connector (J5.c4), SoC_FPGA_128-131_GTY (C500.2)
GTP6TX_N: RTM_Connector (J5.f4), SoC_FPGA_128-131_GTY (C501.2)
GTP6TX_P: RTM_Connector (J5.e4), SoC_FPGA_128-131_GTY (C502.2)
GTP7RX_N: RTM_Connector (J5.d3), SoC_FPGA_128-131_GTY (C495.2)
GTP7RX_P: RTM_Connector (J5.c3), SoC_FPGA_128-131_GTY (C496.2)
GTP7TX_N: RTM_Connector (J5.f3), SoC_FPGA_128-131_GTY (C497.2)
GTP7TX_P: RTM_Connector (J5.e3), SoC_FPGA_128-131_GTY (C498.2)
GTP8-11_CLK_IN_N: RTM_Connector (J5.b1), SoC_FPGA_128-131_GTY (C369.2)
GTP8-11_CLK_IN_P: RTM_Connector (J5.a1), SoC_FPGA_128-131_GTY (C371.2)
GTP8-11_CLK_OUT_N: RTM_Connector (J5.b2), SoC_FPGA_128-131_GTY (IC36.2)
GTP8-11_CLK_OUT_P: RTM_Connector (J5.a2), SoC_FPGA_128-131_GTY (IC36.1)
GTP8RX_N: RTM_Connector (J5.d2), SoC_FPGA_128-131_GTY (C468.2)
GTP8RX_P: RTM_Connector (J5.c2), SoC_FPGA_128-131_GTY (C490.2)